# Altium project ADAPTONE_CARTE_DE_SON.PrjPCB (part 2 of 3)

## Sheet ADC.SchDoc
size Tabloid; DocumentNumber: 6; SheetNumber: 6; SheetTotal: 11; SheetName: ADC; Size: 11x17; Sheet_Name: ADC
Used 2 times, as channels ADC1, ADC2. Parts and nets are listed once, with the designators drawn on the sheet.
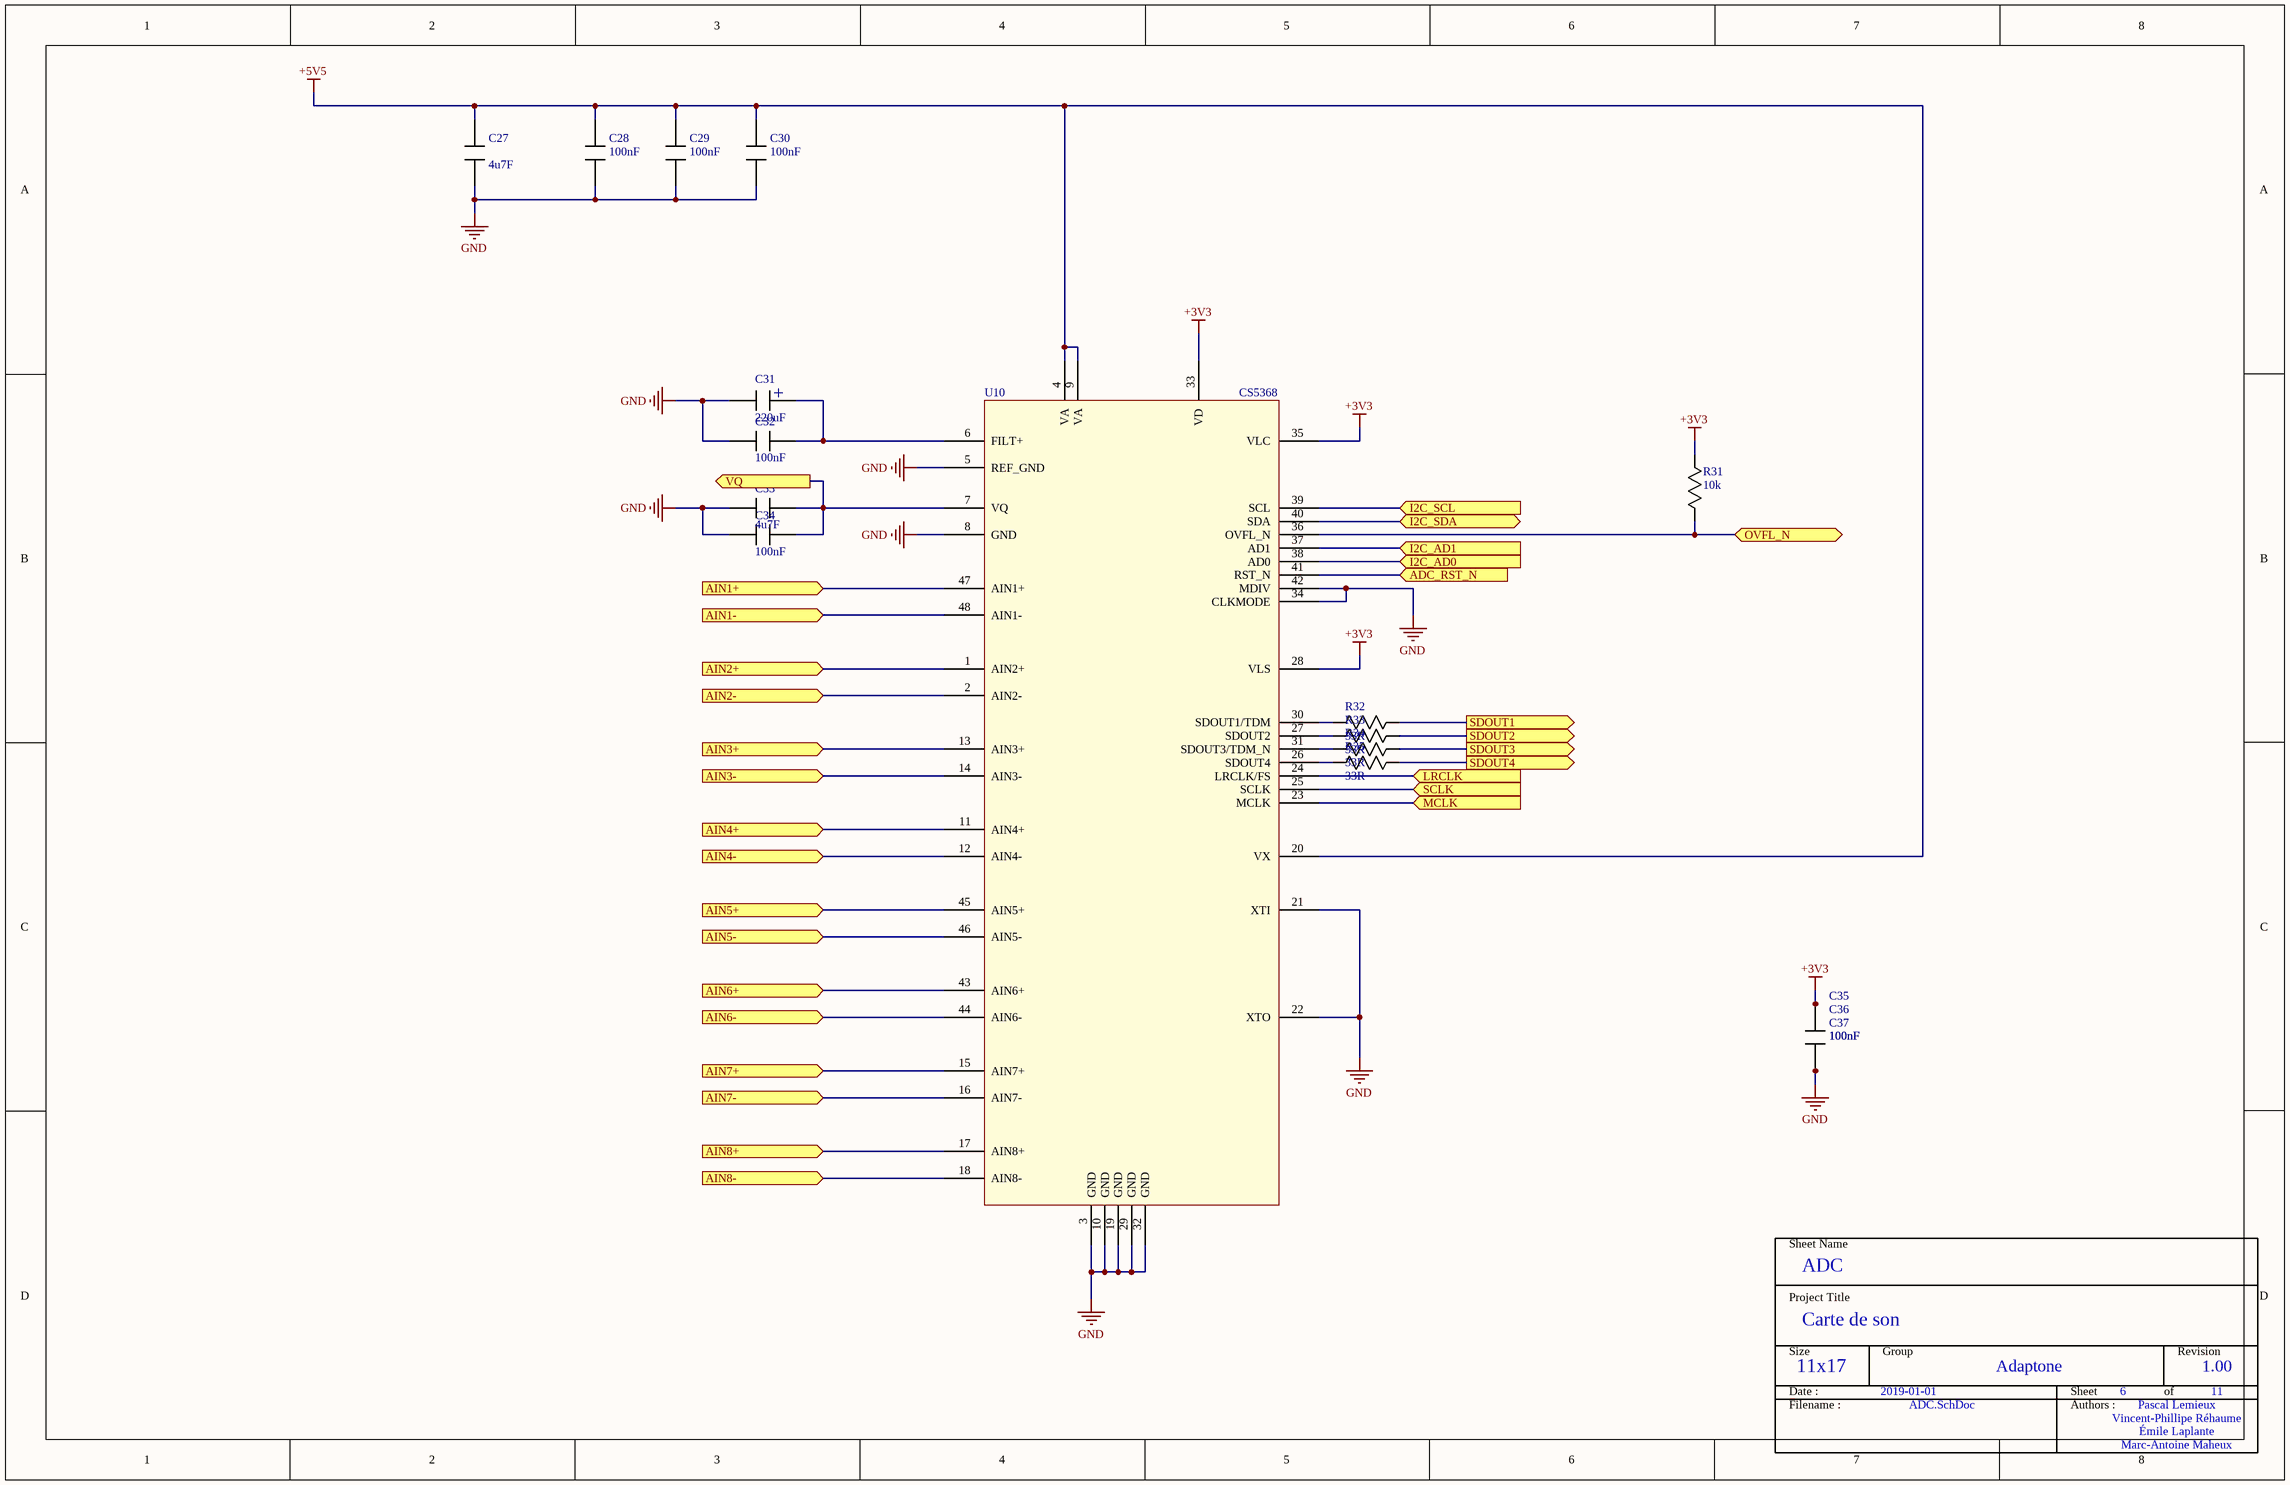
[diagram p5: ADC.SchDoc]

### Parts
C27  value 4u7F  [0805]  (hidden comment: Capacitor)
C28  value 100nF  [0603]  (hidden comment: Capacitor)
C29  value 100nF  [0603]  (hidden comment: Capacitor)
C30  value 100nF  [0603]  (hidden comment: Capacitor)
C31  value 220uF  [CAP_RAD_SMD_DIA315]  (hidden comment: Capacitor_Polarized_1)
C32  value 100nF  [0603]  (hidden comment: Capacitor)
C33  value 4u7F  [0805]  (hidden comment: Capacitor)
C34  value 100nF  [0603]  (hidden comment: Capacitor)
C35  value 100nF  [0603]  (hidden comment: Capacitor)
C36  value 100nF  [0603]  (hidden comment: Capacitor)
C37  value 100nF  [0603]  (hidden comment: Capacitor)
R31  value 10k  [0603]  (hidden comment: Resistor)
R32  value 33R  [0603]  (hidden comment: Resistor)
R33  value 33R  [0603]  (hidden comment: Resistor)
R34  value 33R  [0603]  (hidden comment: Resistor)
R35  value 33R  [0603]  (hidden comment: Resistor)
U10  CS5368  [LQFP_48L_CIRRUS]

### Ports
ADC_RST_N (in), AIN1+ (in), AIN1- (in), AIN2+ (in), AIN2- (in), AIN3+ (in), AIN3- (in), AIN4+ (in), AIN4- (in), AIN5+ (in), AIN5- (in), AIN6+ (in), AIN6- (in), AIN7+ (in), AIN7- (in), AIN8+ (in), AIN8- (in), I2C_AD0 (in), I2C_AD1 (in), I2C_SCL (in), I2C_SDA (bidir), LRCLK (in), MCLK (in), OVFL_N (bidir), SCLK (in), SDOUT1 (out), SDOUT2 (out), SDOUT3 (out), SDOUT4 (out), VQ (out)

### Nets
+3V3: C35.1 C36.1 C37.1 R31.1 U10.28(VLS) U10.33(VD) U10.35(VLC)
+5V5: C27.1 C28.1 C29.1 C30.1 U10.4(VA) U10.9(VA) U10.20(VX)
GND: C27.2 C28.2 C29.2 C30.2 C31.- C32.2 C33.2 C34.2 C35.2 C36.2 C37.2 U10.3(GND) U10.5(REF_GND) U10.8(GND) U10.10(GND) U10.19(GND) U10.21(XTI) U10.22(XTO) U10.29(GND) U10.32(GND) U10.34(CLKMODE) U10.42(MDIV)
ADC_RST_N: U10.41(RST_N) ; port ADC_RST_N
AIN1+: U10.47(AIN1+) ; port AIN1+
AIN1-: U10.48(AIN1-) ; port AIN1-
AIN2+: U10.1(AIN2+) ; port AIN2+
AIN2-: U10.2(AIN2-) ; port AIN2-
AIN3+: U10.13(AIN3+) ; port AIN3+
AIN3-: U10.14(AIN3-) ; port AIN3-
AIN4+: U10.11(AIN4+) ; port AIN4+
AIN4-: U10.12(AIN4-) ; port AIN4-
AIN5+: U10.45(AIN5+) ; port AIN5+
AIN5-: U10.46(AIN5-) ; port AIN5-
AIN6+: U10.43(AIN6+) ; port AIN6+
AIN6-: U10.44(AIN6-) ; port AIN6-
AIN7+: U10.15(AIN7+) ; port AIN7+
AIN7-: U10.16(AIN7-) ; port AIN7-
AIN8+: U10.17(AIN8+) ; port AIN8+
AIN8-: U10.18(AIN8-) ; port AIN8-
I2C_AD0: U10.38(AD0) ; port I2C_AD0
I2C_AD1: U10.37(AD1) ; port I2C_AD1
I2C_SCL: U10.39(SCL) ; port I2C_SCL
I2C_SDA: U10.40(SDA) ; port I2C_SDA
LRCLK: U10.24(LRCLK/FS) ; port LRCLK
MCLK: U10.23(MCLK) ; port MCLK
OVFL_N: R31.2 U10.36(OVFL_N) ; port OVFL_N
SCLK: U10.25(SCLK) ; port SCLK
SDOUT1: R32.2 ; port SDOUT1
SDOUT2: R33.2 ; port SDOUT2
SDOUT3: R34.2 ; port SDOUT3
SDOUT4: R35.2 ; port SDOUT4
VQ: C33.1 C34.1 U10.7(VQ) ; port VQ
NetC31_+: C31.+ C32.1 U10.6(FILT+)
NetR32_1: R32.1 U10.30(SDOUT1/TDM)
NetR33_1: R33.1 U10.27(SDOUT2)
NetR34_1: R34.1 U10.31(SDOUT3/TDM_N)
NetR35_1: R35.1 U10.26(SDOUT4)

### Channels
ADC1: designators end in .1; ports ADC_RST_N=NetTP6_1 AIN1+=IN1_P AIN1-=IN1_N AIN2+=IN2_P AIN2-=IN2_N AIN3+=IN3_P AIN3-=IN3_N AIN4+=IN4_P AIN4-=IN4_N AIN5+=IN5_P AIN5-=IN5_N AIN6+=IN6_P AIN6-=IN6_N AIN7+=IN7_P AIN7-=IN7_N AIN8+=IN8_P AIN8-=IN8_N I2C_AD0=+3V3 I2C_AD1=GND I2C_SCL=I2C_SCL I2C_SDA=I2C_SDA LRCLK=LRCLK MCLK=MCLK_AUDIO OVFL_N=NetR31.1_2 SCLK=SCLK SDOUT1=ADC1_SDOUT1 SDOUT2=ADC1_SDOUT2 SDOUT3=ADC1_SDOUT3 SDOUT4=ADC1_SDOUT4 VQ=ADC1_VQ
ADC2: designators end in .2; ports ADC_RST_N=NetTP6_1 AIN1+=IN9_P AIN1-=IN9_N AIN2+=IN10_P AIN2-=IN10_N AIN3+=IN11_P AIN3-=IN11_N AIN4+=IN12_P AIN4-=IN12_N AIN5+=IN13_P AIN5-=IN13_N AIN6+=IN14_P AIN6-=IN14_N AIN7+=IN15_P AIN7-=IN15_N AIN8+=IN16_P AIN8-=IN16_N I2C_AD0=GND I2C_AD1=GND I2C_SCL=I2C_SCL I2C_SDA=I2C_SDA LRCLK=LRCLK MCLK=MCLK_AUDIO OVFL_N=NetR31.1_2 SCLK=SCLK SDOUT1=ADC2_SDOUT1 SDOUT2=ADC2_SDOUT2 SDOUT3=ADC2_SDOUT3 SDOUT4=ADC2_SDOUT4 VQ=ADC2_VQ

### Notes on the sheet
- Sheet Name
- Project Title
- Size
- Group
- Revision
- Date :
- Filename :
- Sheet
- Authors :
- of

### Library data of the parts
C27 C33 = Capacitor: Mfg: Samsung; Mfg_PN: CL21A475KAQNNNG; HelpURL: *; NI: *; Supplier1: Digikey; Supplier1_PN: 1276-6462-1-ND; Tolerance: *; Type: *; Rating: *
C28-C30 C32 C34-C37 = Capacitor: Mfg: Samsung; Mfg_PN: CL10F104ZO8NNNC; HelpURL: *; NI: *; Supplier1: Digikey; Supplier1_PN: 1276-1258-1-ND; Tolerance: *; Type: *; Rating: *
C31 = Capacitor_Polarized_1: Capacitor; Mfg: Nichicon; Mfg_PN: UWT1E221MNL1GS; HelpURL: *; NI: *; Supplier1: Digikey; Supplier1_PN: 493-2192-1-ND; Tolerance: *; Type: *; Rating: *
R31 = Resistor: Mfg: Yageo; Mfg_PN: RC0603JR-0710KL; HelpURL: *; NI: *; Supplier1: Digikey; Supplier1_PN: 311-10KGRCT-ND; Type: *; Rating: *; Tolerance: *
R32-R35 = Resistor: Mfg: Yageo; Mfg_PN: RC0603JR-0733RL; HelpURL: *; NI: *; Supplier1: Digikey; Supplier1_PN: 311-33GRCT-ND; Type: *; Rating: *; Tolerance: *
U10 = CS5368: ADC, 24bit, 8 chan, 192kHz, PCM, TDM, LQFP48; Mfg_PN: CS5368-CQZ; Mfg: Cirrus; Supplier1: Digikey; Supplier1_PN: 598-1090-ND

## Sheet DAC.SchDoc
size Tabloid; DocumentNumber: 7; SheetNumber: 7; SheetTotal: 11; SheetName: DAC; Size: 11x17; Sheet_Name: DAC
Used 2 times, as channels DAC2, DAC1. Parts and nets are listed once, with the designators drawn on the sheet.
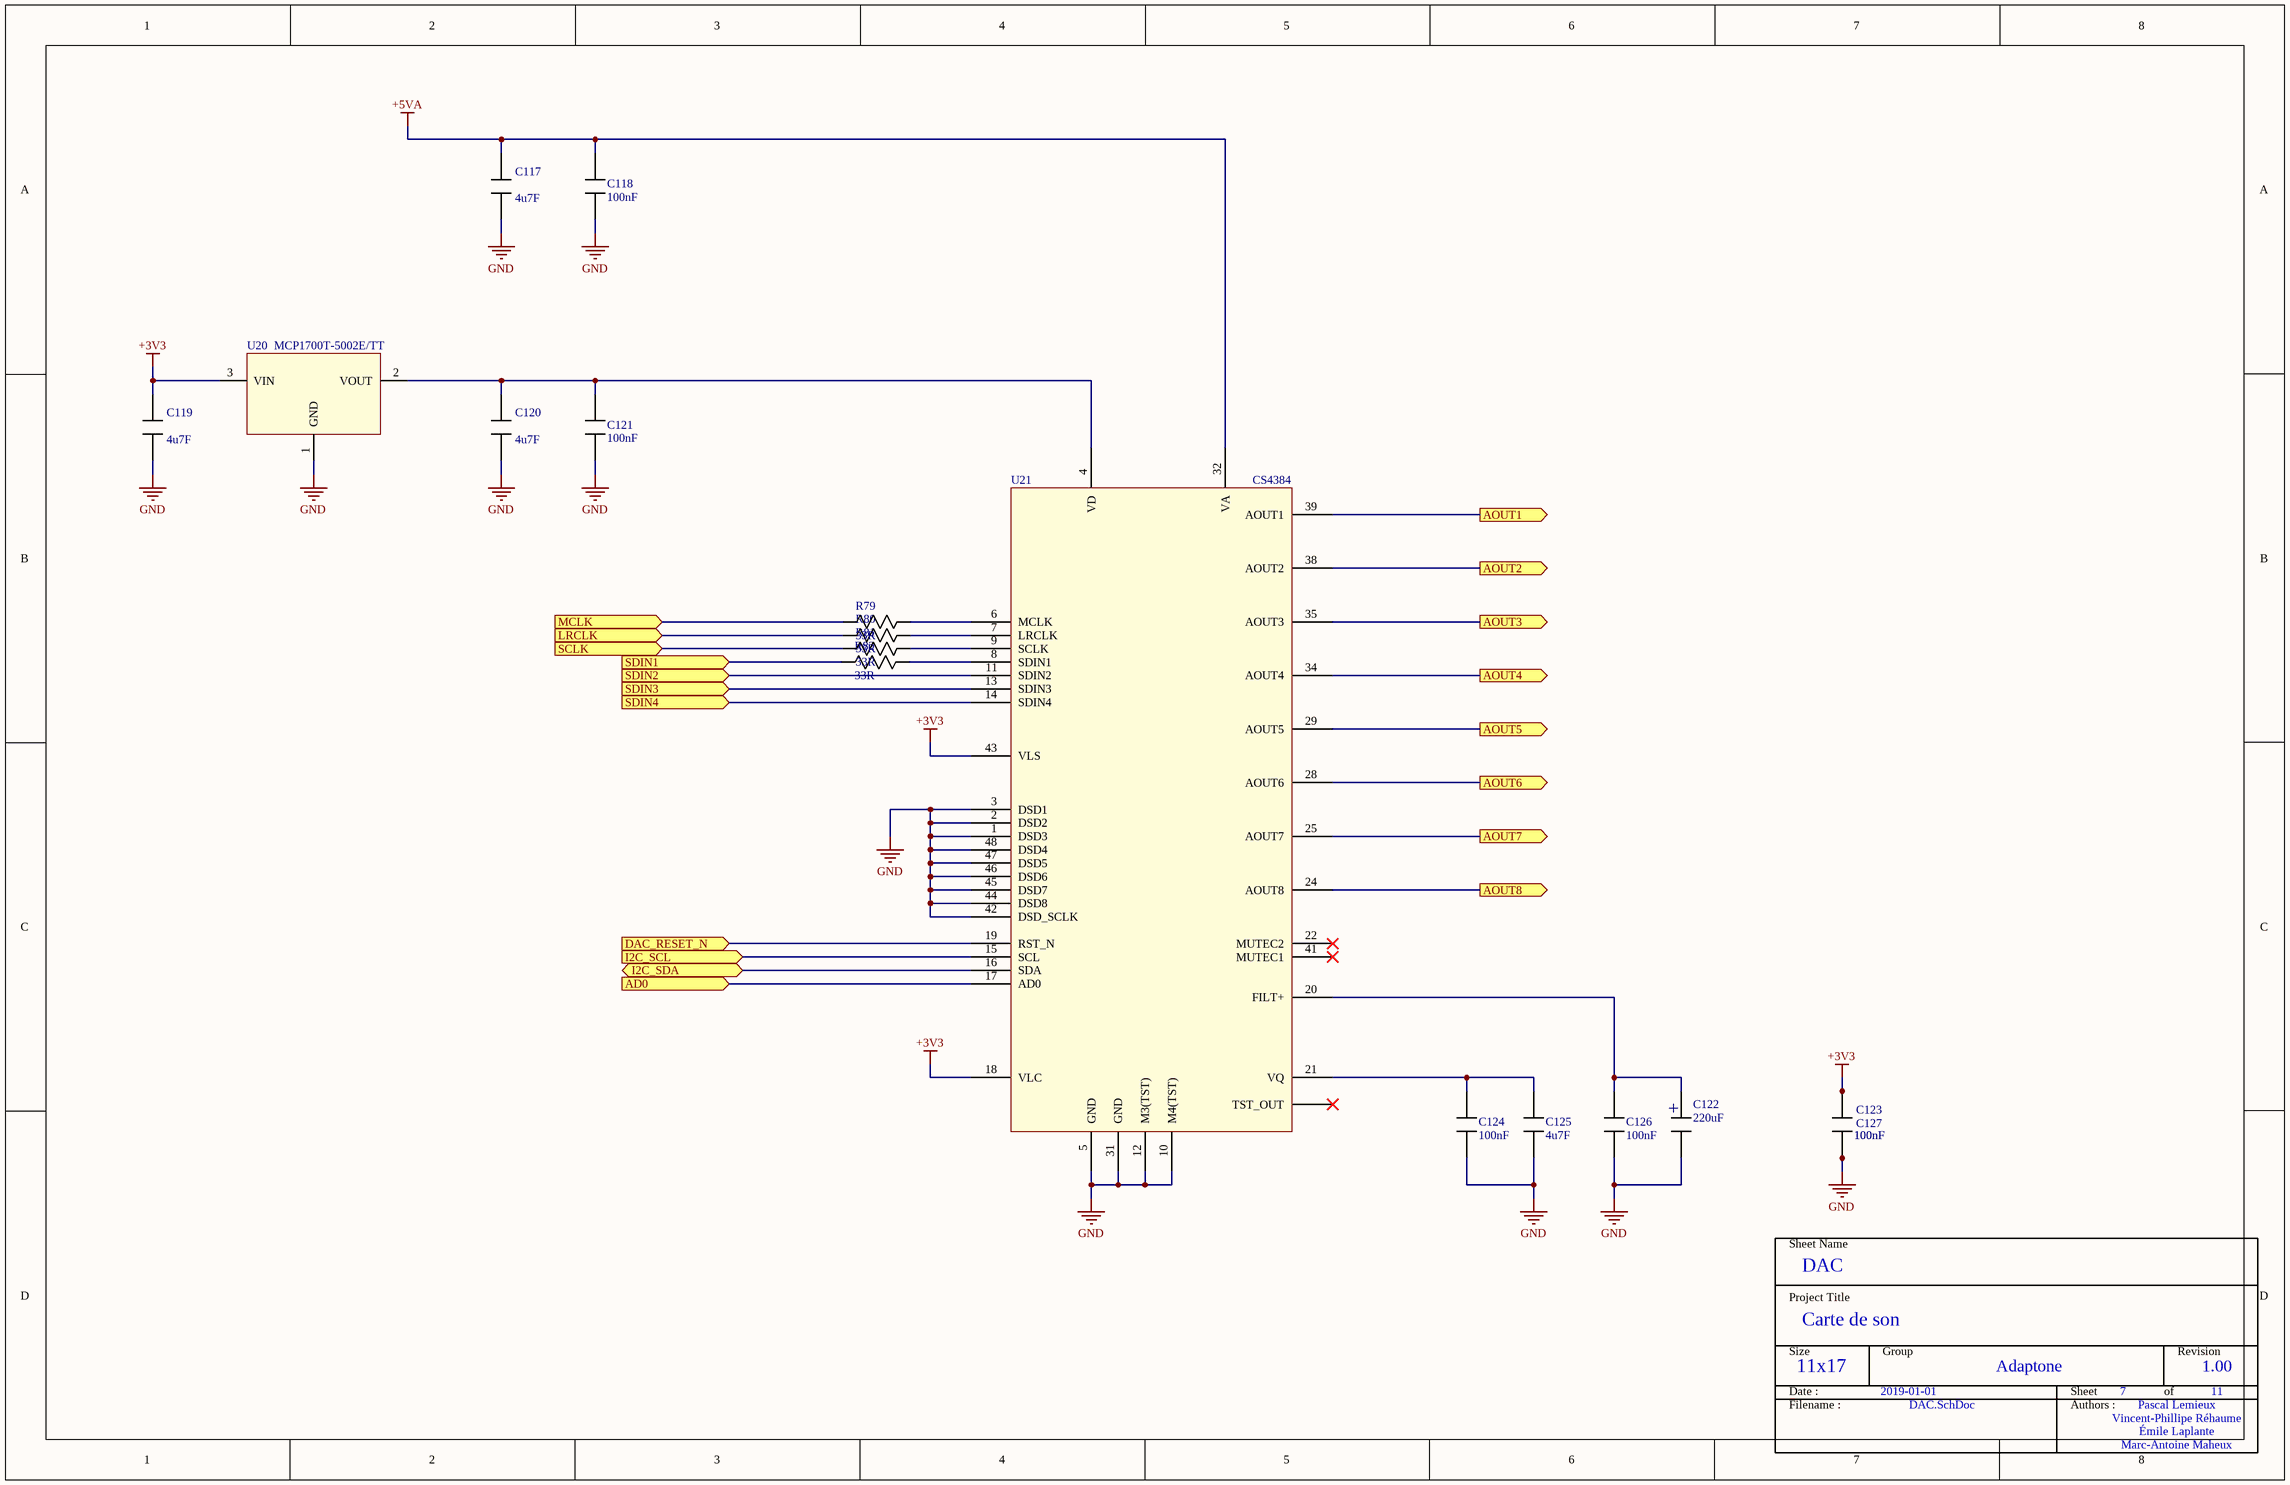
[diagram p6: DAC.SchDoc]

### Parts
C117  value 4u7F  [0603]  (hidden comment: Capacitor)
C118  value 100nF  [0603]  (hidden comment: Capacitor)
C119  value 4u7F  [0603]  (hidden comment: Capacitor)
C120  value 4u7F  [0603]  (hidden comment: Capacitor)
C121  value 100nF  [0603]  (hidden comment: Capacitor)
C122  value 220uF  [CAP_RAD_SMD_DIA315]  (hidden comment: Capacitor_Polarized_1)
C123  value 100nF  [0603]  (hidden comment: Capacitor)
C124  value 100nF  [0603]  (hidden comment: Capacitor)
C125  value 4u7F  [0603]  (hidden comment: Capacitor)
C126  value 100nF  [0603]  (hidden comment: Capacitor)
C127  value 100nF  [0603]  (hidden comment: Capacitor)
R79  value 33R  [0603]  (hidden comment: Resistor)
R80  value 33R  [0603]  (hidden comment: Resistor)
R81  value 33R  [0603]  (hidden comment: Resistor)
R82  value 33R  [0603]  (hidden comment: Resistor)
U20  Mfg_PN: MCP1700T-5002E/TT  [SOT23_132]  (hidden comment: MCP1700)
U21  CS4384  [LQFP_48L_CIRRUS]

### Ports
AD0 (in), AOUT1 (out), AOUT2 (out), AOUT3 (out), AOUT4 (out), AOUT5 (out), AOUT6 (out), AOUT7 (out), AOUT8 (out), DAC_RESET_N (in), I2C_SCL (in), I2C_SDA (bidir), LRCLK (in), MCLK (in), SCLK (in), SDIN1 (in), SDIN2 (in), SDIN3 (in), SDIN4 (in)

### Nets
+3V3: C119.1 C123.1 C127.1 U20.3(VIN) U21.18(VLC) U21.43(VLS)
+5VA: C117.1 C118.1 U21.32(VA)
GND: C117.2 C118.2 C119.2 C120.2 C121.2 C122.- C123.2 C124.2 C125.2 C126.2 C127.2 U20.1(GND) U21.1(DSD3) U21.2(DSD2) U21.3(DSD1) U21.5(GND) U21.10(M4(TST)) U21.12(M3(TST)) U21.31(GND) U21.42(DSD_SCLK) U21.44(DSD8) U21.45(DSD7) U21.46(DSD6) U21.47(DSD5) U21.48(DSD4)
AD0: U21.17(AD0) ; port AD0
AOUT1: U21.39(AOUT1) ; port AOUT1
AOUT2: U21.38(AOUT2) ; port AOUT2
AOUT3: U21.35(AOUT3) ; port AOUT3
AOUT4: U21.34(AOUT4) ; port AOUT4
AOUT5: U21.29(AOUT5) ; port AOUT5
AOUT6: U21.28(AOUT6) ; port AOUT6
AOUT7: U21.25(AOUT7) ; port AOUT7
AOUT8: U21.24(AOUT8) ; port AOUT8
DAC_RESET_N: U21.19(RST_N) ; port DAC_RESET_N
I2C_SCL: U21.15(SCL) ; port I2C_SCL
I2C_SDA: U21.16(SDA) ; port I2C_SDA
LRCLK: R80.1 ; port LRCLK
MCLK: R79.1 ; port MCLK
SCLK: R81.1 ; port SCLK
SDIN1: R82.1 ; port SDIN1
SDIN2: U21.11(SDIN2) ; port SDIN2
SDIN3: U21.13(SDIN3) ; port SDIN3
SDIN4: U21.14(SDIN4) ; port SDIN4
NetC120_1: C120.1 C121.1 U20.2(VOUT) U21.4(VD)
NetC122_+: C122.+ C126.1 U21.20(FILT+)
NetC124_1: C124.1 C125.1 U21.21(VQ)
NetR79_2: R79.2 U21.6(MCLK)
NetR80_2: R80.2 U21.7(LRCLK)
NetR81_2: R81.2 U21.9(SCLK)
NetR82_2: R82.2 U21.8(SDIN1)

Not connected (* = marked no-connect by the designer): U21 22(MUTEC2)* 23(TST_OUT) 26(TST_OUT) 27(TST_OUT) 30(TST_OUT) 33(TST_OUT) 36(TST_OUT) 37(TST_OUT) 40(TST_OUT)* 41(MUTEC1)*

### Channels
DAC2: designators end in .1; ports AD0=+3V3 AOUT1=AOUT9 AOUT2=AOUT10 AOUT3=AOUT11 AOUT4=AOUT12 AOUT5=AOUT13 AOUT6=AOUT14 AOUT7=AOUT15 AOUT8=AOUT16 DAC_RESET_N=NetU8_94 I2C_SCL=I2C_SCL I2C_SDA=I2C_SDA LRCLK=FSYNC MCLK=MCLK_AUDIO SCLK=BCLK SDIN1=DAC2_SDIN1_TDM SDIN2=NetU21.1_11 SDIN3=NetU21.1_13 SDIN4=NetU21.1_14
DAC1: designators end in .2; ports AD0=GND AOUT1=AOUT1 AOUT2=AOUT2 AOUT3=AOUT3 AOUT4=AOUT4 AOUT5=AOUT5 AOUT6=AOUT6 AOUT7=AOUT7 AOUT8=AOUT8 DAC_RESET_N=NetU8_94 I2C_SCL=I2C_SCL I2C_SDA=I2C_SDA LRCLK=FSYNC MCLK=MCLK_AUDIO SCLK=BCLK SDIN1=DAC1_SDIN1_TDM SDIN2=NetU21.2_11 SDIN3=NetU21.2_13 SDIN4=NetU21.2_14

### Notes on the sheet
- Sheet Name
- Project Title
- Size
- Group
- Revision
- Date :
- Filename :
- Sheet
- Authors :
- of

### Library data of the parts
C117 C119 C120 C125 = Capacitor: Mfg: Samsung; Mfg_PN: CL21A475KAQNNNG; HelpURL: *; NI: *; Supplier1: Digikey; Supplier1_PN: 1276-6462-1-ND; Tolerance: *; Type: *; Rating: *
C118 C121 C123 C124 C126 C127 = Capacitor: Mfg: Samsung; Mfg_PN: CL10F104ZO8NNNC; HelpURL: *; NI: *; Supplier1: Digikey; Supplier1_PN: 1276-1258-1-ND; Tolerance: *; Type: *; Rating: *
C122 = Capacitor_Polarized_1: as C31 on sheet ADC; HelpURL: *; NI: *; Supplier1: Digikey; Supplier1_PN: 493-2192-1-ND; Tolerance: *; Type: *; Rating: *
R79-R82 = Resistor: Mfg: Yageo; Mfg_PN: RC0603JR-0733RL; HelpURL: *; NI: *; Supplier1: Digikey; Supplier1_PN: 311-33GRCT-ND; Type: *; Rating: *; Tolerance: *
U20 = MCP1700: Linear voltage regulator; Mfg: Microchip; HelpURL: http://ww1.microchip.com/downloads/en/DeviceDoc/20001826C.pdf; NI: *; Supplier1: Digikey; Supplier1_PN: MCP1700T5002ETTCT-ND; Type: *
U21 = CS4384: DAC, 24-bit, 8 chan, 192kHz, PCM, TDM, DSD, LQFP48; Mfg: Cirrus; Mfg_PN: CS4384-CQZ; Supplier1: Digikey; Supplier1_PN: 598-1062-ND

## Sheet AudioInputs_16.SchDoc
size Tabloid; DocumentNumber: 10; SheetNumber: 10; SheetTotal: 11; SheetName: Analog input (group); Size: 11x17; Sheet_Name: AudiInputs_16
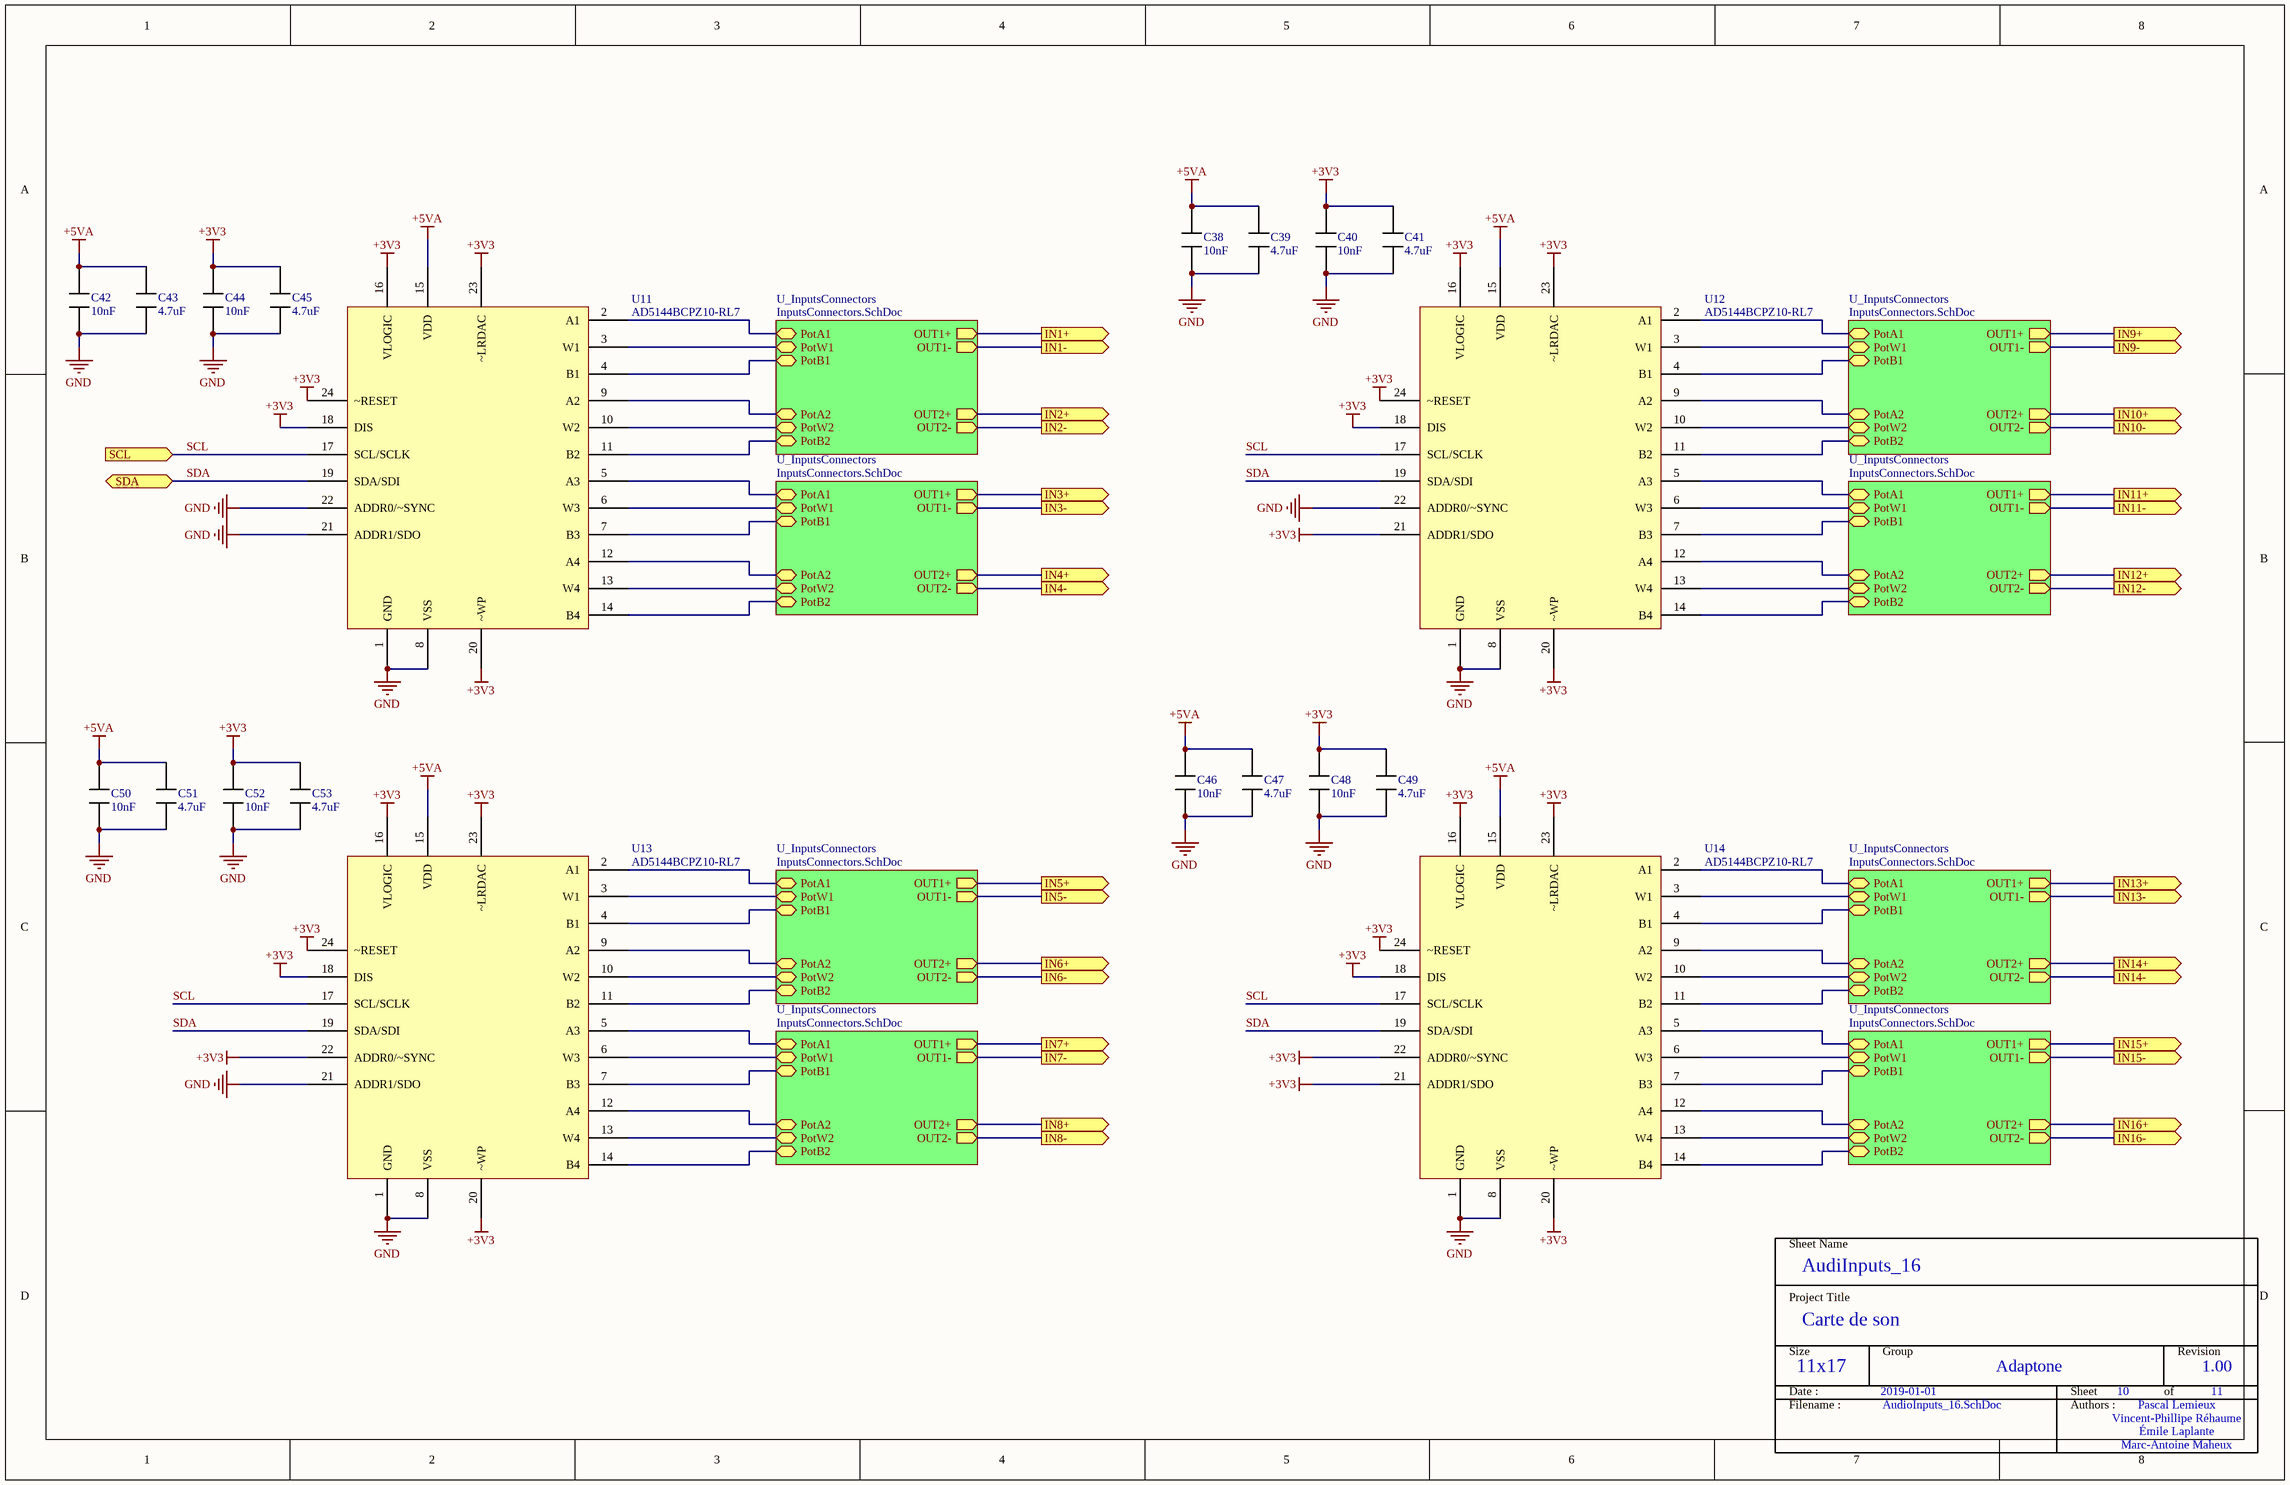
[diagram p7: AudioInputs_16.SchDoc]

### Parts
C38  value 10nF  [0402]  (hidden comment: Capacitor)
C39  value 4.7uF  [0402]  (hidden comment: Capacitor)
C40  value 10nF  [0402]  (hidden comment: Capacitor)
C41  value 4.7uF  [0402]  (hidden comment: Capacitor)
C42  value 10nF  [0402]  (hidden comment: Capacitor)
C43  value 4.7uF  [0402]  (hidden comment: Capacitor)
C44  value 10nF  [0402]  (hidden comment: Capacitor)
C45  value 4.7uF  [0402]  (hidden comment: Capacitor)
C46  value 10nF  [0402]  (hidden comment: Capacitor)
C47  value 4.7uF  [0402]  (hidden comment: Capacitor)
C48  value 10nF  [0402]  (hidden comment: Capacitor)
C49  value 4.7uF  [0402]  (hidden comment: Capacitor)
C50  value 10nF  [0402]  (hidden comment: Capacitor)
C51  value 4.7uF  [0402]  (hidden comment: Capacitor)
C52  value 10nF  [0402]  (hidden comment: Capacitor)
C53  value 4.7uF  [0402]  (hidden comment: Capacitor)
U11  AD5144BCPZ10-RL7  [QFN50P400X400X100-25N]
U12  AD5144BCPZ10-RL7  [QFN50P400X400X100-25N]
U13  AD5144BCPZ10-RL7  [QFN50P400X400X100-25N]
U14  AD5144BCPZ10-RL7  [QFN50P400X400X100-25N]

### Sub-sheets
U_InputsConnectors = InputsConnectors.SchDoc: OUT1+ (out), OUT1- (out), OUT2+ (out), OUT2- (out), PotA1 (bidir), PotW1 (bidir), PotB1 (bidir), PotA2 (bidir), PotW2 (bidir), PotB2 (bidir)
U_InputsConnectors = InputsConnectors.SchDoc: OUT1+ (out), OUT1- (out), OUT2+ (out), OUT2- (out), PotA1 (bidir), PotW1 (bidir), PotB1 (bidir), PotA2 (bidir), PotW2 (bidir), PotB2 (bidir)
U_InputsConnectors = InputsConnectors.SchDoc: OUT1+ (out), OUT1- (out), OUT2+ (out), OUT2- (out), PotA1 (bidir), PotW1 (bidir), PotB1 (bidir), PotA2 (bidir), PotW2 (bidir), PotB2 (bidir)
U_InputsConnectors = InputsConnectors.SchDoc: OUT1+ (out), OUT1- (out), OUT2+ (out), OUT2- (out), PotA1 (bidir), PotW1 (bidir), PotB1 (bidir), PotA2 (bidir), PotW2 (bidir), PotB2 (bidir)
U_InputsConnectors = InputsConnectors.SchDoc: OUT1+ (out), OUT1- (out), OUT2+ (out), OUT2- (out), PotA1 (bidir), PotW1 (bidir), PotB1 (bidir), PotA2 (bidir), PotW2 (bidir), PotB2 (bidir)
U_InputsConnectors = InputsConnectors.SchDoc: OUT1+ (out), OUT1- (out), OUT2+ (out), OUT2- (out), PotA1 (bidir), PotW1 (bidir), PotB1 (bidir), PotA2 (bidir), PotW2 (bidir), PotB2 (bidir)
U_InputsConnectors = InputsConnectors.SchDoc: OUT1+ (out), OUT1- (out), OUT2+ (out), OUT2- (out), PotA1 (bidir), PotW1 (bidir), PotB1 (bidir), PotA2 (bidir), PotW2 (bidir), PotB2 (bidir)
U_InputsConnectors = InputsConnectors.SchDoc: OUT1+ (out), OUT1- (out), OUT2+ (out), OUT2- (out), PotA1 (bidir), PotW1 (bidir), PotB1 (bidir), PotA2 (bidir), PotW2 (bidir), PotB2 (bidir)

### Ports
IN1+ (out), IN1- (out), IN2+ (out), IN2- (out), IN3+ (out), IN3- (out), IN4+ (out), IN4- (out), IN5+ (out), IN5- (out), IN6+ (out), IN6- (out), IN7+ (out), IN7- (out), IN8+ (out), IN8- (out), IN9+ (out), IN9- (out), IN10+ (out), IN10- (out), IN11+ (out), IN11- (out), IN12+ (out), IN12- (out), IN13+ (out), IN13- (out), IN14+ (out), IN14- (out), IN15+ (out), IN15- (out), IN16+ (out), IN16- (out), SCL (in), SDA (bidir)

### Nets
+3V3: C40.1 C41.1 C44.1 C45.1 C48.1 C49.1 C52.1 C53.1 U11.16(VLOGIC) U11.18(DIS) U11.20(~WP) U11.23(~LRDAC) U11.24(~RESET) U12.16(VLOGIC) U12.18(DIS) U12.20(~WP) U12.21(ADDR1/SDO) U12.23(~LRDAC) U12.24(~RESET) U13.16(VLOGIC) U13.18(DIS) U13.20(~WP) U13.22(ADDR0/~SYNC) U13.23(~LRDAC) U13.24(~RESET) U14.16(VLOGIC) U14.18(DIS) U14.20(~WP) U14.21(ADDR1/SDO) U14.22(ADDR0/~SYNC) U14.23(~LRDAC) U14.24(~RESET)
+5VA: C38.1 C39.1 C42.1 C43.1 C46.1 C47.1 C50.1 C51.1 U11.15(VDD) U12.15(VDD) U13.15(VDD) U14.15(VDD)
GND: C38.2 C39.2 C40.2 C41.2 C42.2 C43.2 C44.2 C45.2 C46.2 C47.2 C48.2 C49.2 C50.2 C51.2 C52.2 C53.2 U11.1(GND) U11.8(VSS) U11.21(ADDR1/SDO) U11.22(ADDR0/~SYNC) U12.1(GND) U12.8(VSS) U12.22(ADDR0/~SYNC) U13.1(GND) U13.8(VSS) U13.21(ADDR1/SDO) U14.1(GND) U14.8(VSS)
IN1_N: port IN1-, sheet U_InputsConnectors/OUT1-
IN1_P: port IN1+, sheet U_InputsConnectors/OUT1+
IN2_N: port IN2-, sheet U_InputsConnectors/OUT2-
IN2_P: port IN2+, sheet U_InputsConnectors/OUT2+
IN3_N: port IN3-, sheet U_InputsConnectors/OUT1-
IN3_P: port IN3+, sheet U_InputsConnectors/OUT1+
IN4_N: port IN4-, sheet U_InputsConnectors/OUT2-
IN4_P: port IN4+, sheet U_InputsConnectors/OUT2+
IN5_N: port IN5-, sheet U_InputsConnectors/OUT1-
IN5_P: port IN5+, sheet U_InputsConnectors/OUT1+
IN6_N: port IN6-, sheet U_InputsConnectors/OUT2-
IN6_P: port IN6+, sheet U_InputsConnectors/OUT2+
IN7_N: port IN7-, sheet U_InputsConnectors/OUT1-
IN7_P: port IN7+, sheet U_InputsConnectors/OUT1+
IN8_N: port IN8-, sheet U_InputsConnectors/OUT2-
IN8_P: port IN8+, sheet U_InputsConnectors/OUT2+
IN9_N: port IN9-, sheet U_InputsConnectors/OUT1-
IN9_P: port IN9+, sheet U_InputsConnectors/OUT1+
IN10_N: port IN10-, sheet U_InputsConnectors/OUT2-
IN10_P: port IN10+, sheet U_InputsConnectors/OUT2+
IN11_N: port IN11-, sheet U_InputsConnectors/OUT1-
IN11_P: port IN11+, sheet U_InputsConnectors/OUT1+
IN12_N: port IN12-, sheet U_InputsConnectors/OUT2-
IN12_P: port IN12+, sheet U_InputsConnectors/OUT2+
IN13_N: port IN13-, sheet U_InputsConnectors/OUT1-
IN13_P: port IN13+, sheet U_InputsConnectors/OUT1+
IN14_N: port IN14-, sheet U_InputsConnectors/OUT2-
IN14_P: port IN14+, sheet U_InputsConnectors/OUT2+
IN15_N: port IN15-, sheet U_InputsConnectors/OUT1-
IN15_P: port IN15+, sheet U_InputsConnectors/OUT1+
IN16_N: port IN16-, sheet U_InputsConnectors/OUT2-
IN16_P: port IN16+, sheet U_InputsConnectors/OUT2+
SCL: U11.17(SCL/SCLK) U12.17(SCL/SCLK) U13.17(SCL/SCLK) U14.17(SCL/SCLK) ; port SCL  [project net I2C_SCL]
SDA: U11.19(SDA/SDI) U12.19(SDA/SDI) U13.19(SDA/SDI) U14.19(SDA/SDI) ; port SDA  [project net I2C_SDA]
V1: U11.3(W1) ; sheet U_InputsConnectors/PotW1
V1: U11.6(W3) ; sheet U_InputsConnectors/PotW1  [a separate net that carries the same name]
V1: U11.10(W2) ; sheet U_InputsConnectors/PotW2  [a separate net that carries the same name]
V1: U11.13(W4) ; sheet U_InputsConnectors/PotW2  [a separate net that carries the same name]
V1: U13.3(W1) ; sheet U_InputsConnectors/PotW1  [a separate net that carries the same name]
V1: U13.6(W3) ; sheet U_InputsConnectors/PotW1  [a separate net that carries the same name]
V1: U13.10(W2) ; sheet U_InputsConnectors/PotW2  [a separate net that carries the same name]
V1: U13.13(W4) ; sheet U_InputsConnectors/PotW2  [a separate net that carries the same name]
V1: U12.3(W1) ; sheet U_InputsConnectors/PotW1  [a separate net that carries the same name]
V1: U12.6(W3) ; sheet U_InputsConnectors/PotW1  [a separate net that carries the same name]
V1: U12.10(W2) ; sheet U_InputsConnectors/PotW2  [a separate net that carries the same name]
V1: U12.13(W4) ; sheet U_InputsConnectors/PotW2  [a separate net that carries the same name]
V1: U14.3(W1) ; sheet U_InputsConnectors/PotW1  [a separate net that carries the same name]
V1: U14.6(W3) ; sheet U_InputsConnectors/PotW1  [a separate net that carries the same name]
V1: U14.10(W2) ; sheet U_InputsConnectors/PotW2  [a separate net that carries the same name]
V1: U14.13(W4) ; sheet U_InputsConnectors/PotW2  [a separate net that carries the same name]
NetR62.1_1: U11.2(A1) ; sheet U_InputsConnectors/PotA1
NetR62.2_1: U11.9(A2) ; sheet U_InputsConnectors/PotA2
NetR62.3_1: U11.5(A3) ; sheet U_InputsConnectors/PotA1
NetR62.4_1: U11.12(A4) ; sheet U_InputsConnectors/PotA2
NetR62.5_1: U13.2(A1) ; sheet U_InputsConnectors/PotA1
NetR62.6_1: U13.9(A2) ; sheet U_InputsConnectors/PotA2
NetR62.7_1: U13.5(A3) ; sheet U_InputsConnectors/PotA1
NetR62.8_1: U13.12(A4) ; sheet U_InputsConnectors/PotA2
NetR62.9_1: U12.2(A1) ; sheet U_InputsConnectors/PotA1
NetR62.10_1: U12.9(A2) ; sheet U_InputsConnectors/PotA2
NetR62.11_1: U12.5(A3) ; sheet U_InputsConnectors/PotA1
NetR62.12_1: U12.12(A4) ; sheet U_InputsConnectors/PotA2
NetR62.13_1: U14.2(A1) ; sheet U_InputsConnectors/PotA1
NetR62.14_1: U14.9(A2) ; sheet U_InputsConnectors/PotA2
NetR62.15_1: U14.5(A3) ; sheet U_InputsConnectors/PotA1
NetR62.16_1: U14.12(A4) ; sheet U_InputsConnectors/PotA2
NetR63.1_2: U11.4(B1) ; sheet U_InputsConnectors/PotB1
NetR63.2_2: U11.11(B2) ; sheet U_InputsConnectors/PotB2
NetR63.3_2: U11.7(B3) ; sheet U_InputsConnectors/PotB1
NetR63.4_2: U11.14(B4) ; sheet U_InputsConnectors/PotB2
NetR63.5_2: U13.4(B1) ; sheet U_InputsConnectors/PotB1
NetR63.6_2: U13.11(B2) ; sheet U_InputsConnectors/PotB2
NetR63.7_2: U13.7(B3) ; sheet U_InputsConnectors/PotB1
NetR63.8_2: U13.14(B4) ; sheet U_InputsConnectors/PotB2
NetR63.9_2: U12.4(B1) ; sheet U_InputsConnectors/PotB1
NetR63.10_2: U12.11(B2) ; sheet U_InputsConnectors/PotB2
NetR63.11_2: U12.7(B3) ; sheet U_InputsConnectors/PotB1
NetR63.12_2: U12.14(B4) ; sheet U_InputsConnectors/PotB2
NetR63.13_2: U14.4(B1) ; sheet U_InputsConnectors/PotB1
NetR63.14_2: U14.11(B2) ; sheet U_InputsConnectors/PotB2
NetR63.15_2: U14.7(B3) ; sheet U_InputsConnectors/PotB1
NetR63.16_2: U14.14(B4) ; sheet U_InputsConnectors/PotB2

### Notes on the sheet
- Sheet Name
- Project Title
- Size
- Group
- Revision
- Date :
- Filename :
- Sheet
- Authors :
- of

### Library data of the parts
C38 C40 C42 C44 C46 C48 C50 C52 = Capacitor: Mfg: Samsung; Mfg_PN: CL05B103KO5NNNC; HelpURL: *; NI: *; Supplier1: Digikey; Supplier1_PN: 1276-1051-1-ND; Tolerance: *; Type: *; Rating: *
C39 C41 C43 C45 C47 C49 C51 C53 = Capacitor: Mfg: Samsung; Mfg_PN: CL05A475MP5NRNC; HelpURL: *; NI: *; Supplier1: Digikey; Supplier1_PN: 1276-1482-1-ND; Tolerance: *; Type: *; Rating: *
U11-U14 = AD5144BCPZ10-RL7: Mfg: Analog Devices Inc.; Mfg_PN: AD5144BCPZ10-RL7; Supplier1: Digikey; Supplier1_PN: AD5144BCPZ10-RL7DKR-ND

## Sheet InputsConnectors.SchDoc
size Tabloid; Size: 11x17; Sheet_Name: InputsConnectors
Used 8 times, as channels AUDIO INPUTS/U_InputsConnectors, AUDIO INPUTS/U_InputsConnectors, AUDIO INPUTS/U_InputsConnectors, AUDIO INPUTS/U_InputsConnectors, AUDIO INPUTS/U_InputsConnectors, AUDIO INPUTS/U_InputsConnectors, AUDIO INPUTS/U_InputsConnectors, AUDIO INPUTS/U_InputsConnectors. Parts and nets are listed once, with the designators drawn on the sheet.
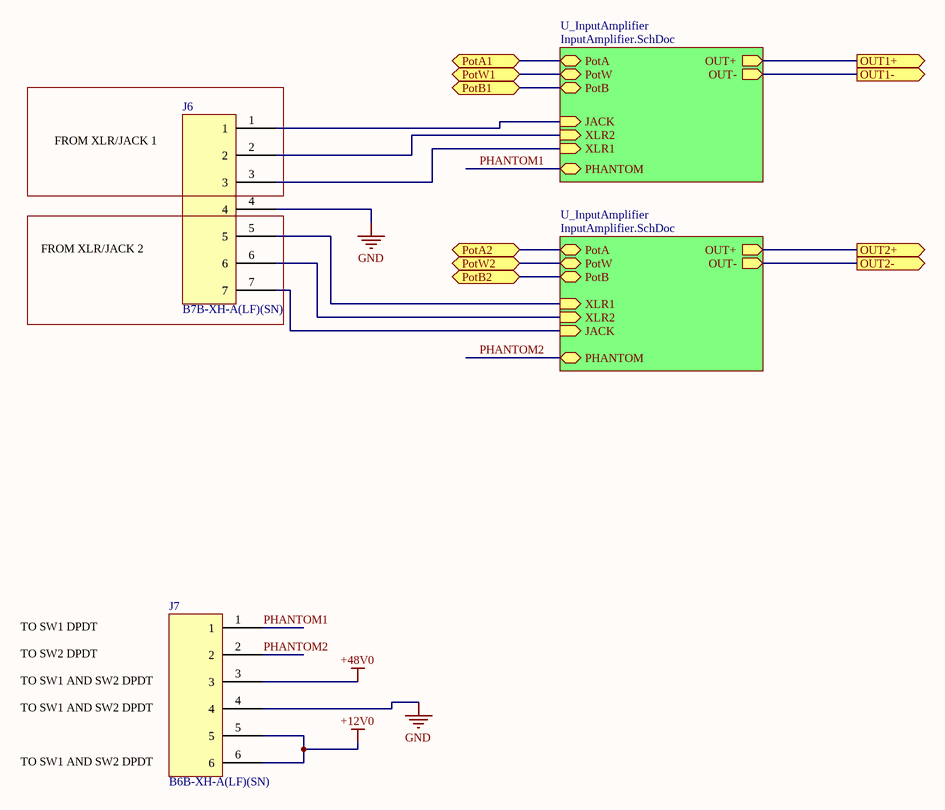
[diagram p8: InputsConnectors.SchDoc]

### Parts
J6  B7B-XH-A(LF)(SN)  [CONN_7_HEADER]
J7  Mfg_PN: B6B-XH-A(LF)(SN)  [CONN_6_HEADER]  (hidden comment: CON_XH_JST_6pins)

### Sub-sheets
U_InputAmplifier = InputAmplifier.SchDoc: OUT+ (out), OUT- (out), PotA (bidir), PotB (bidir), PotW (bidir), XLR1 (in), XLR2 (in), PHANTOM (bidir), JACK (in)
U_InputAmplifier = InputAmplifier.SchDoc: OUT+ (out), OUT- (out), PotA (bidir), PotB (bidir), PotW (bidir), XLR1 (in), XLR2 (in), PHANTOM (bidir), JACK (in)

### Ports
OUT1+ (out), OUT1- (out), OUT2+ (out), OUT2- (out), PotA1 (bidir), PotA2 (bidir), PotB1 (bidir), PotB2 (bidir), PotW1 (bidir), PotW2 (bidir)

### Nets
+12V0: J7.5 J7.6
+48V0: J7.3
GND: J6.4 J7.4
OUT1+: port OUT1+, sheet U_InputAmplifier/OUT+
OUT1-: port OUT1-, sheet U_InputAmplifier/OUT-
OUT2+: port OUT2+, sheet U_InputAmplifier/OUT+
OUT2-: port OUT2-, sheet U_InputAmplifier/OUT-
PHANTOM1: J7.1 ; sheet U_InputAmplifier/PHANTOM
PHANTOM2: J7.2 ; sheet U_InputAmplifier/PHANTOM
PotA1: port PotA1, sheet U_InputAmplifier/PotA
PotA2: port PotA2, sheet U_InputAmplifier/PotA
PotB1: port PotB1, sheet U_InputAmplifier/PotB
PotB2: port PotB2, sheet U_InputAmplifier/PotB
PotW1: port PotW1, sheet U_InputAmplifier/PotW
PotW2: port PotW2, sheet U_InputAmplifier/PotW
NetJ6_1: J6.1 ; sheet U_InputAmplifier/JACK
NetJ6_2: J6.2 ; sheet U_InputAmplifier/XLR2
NetJ6_3: J6.3 ; sheet U_InputAmplifier/XLR1
NetJ6_5: J6.5 ; sheet U_InputAmplifier/XLR1
NetJ6_6: J6.6 ; sheet U_InputAmplifier/XLR2
NetJ6_7: J6.7 ; sheet U_InputAmplifier/JACK

### Channels
AUDIO INPUTS/U_InputsConnectors: designators end in .1; ports OUT1+=IN1_P OUT1-=IN1_N OUT2+=IN2_P OUT2-=IN2_N PotA1=NetR62.1_1 PotA2=NetR62.2_1 PotB1=NetR63.1_2 PotB2=NetR63.2_2 PotW1=V1 PotW2=V1
AUDIO INPUTS/U_InputsConnectors: designators end in .2; ports OUT1+=IN3_P OUT1-=IN3_N OUT2+=IN4_P OUT2-=IN4_N PotA1=NetR62.3_1 PotA2=NetR62.4_1 PotB1=NetR63.3_2 PotB2=NetR63.4_2 PotW1=V1 PotW2=V1
AUDIO INPUTS/U_InputsConnectors: designators end in .3; ports OUT1+=IN5_P OUT1-=IN5_N OUT2+=IN6_P OUT2-=IN6_N PotA1=NetR62.5_1 PotA2=NetR62.6_1 PotB1=NetR63.5_2 PotB2=NetR63.6_2 PotW1=V1 PotW2=V1
AUDIO INPUTS/U_InputsConnectors: designators end in .4; ports OUT1+=IN7_P OUT1-=IN7_N OUT2+=IN8_P OUT2-=IN8_N PotA1=NetR62.7_1 PotA2=NetR62.8_1 PotB1=NetR63.7_2 PotB2=NetR63.8_2 PotW1=V1 PotW2=V1
AUDIO INPUTS/U_InputsConnectors: designators end in .5; ports OUT1+=IN9_P OUT1-=IN9_N OUT2+=IN10_P OUT2-=IN10_N PotA1=NetR62.9_1 PotA2=NetR62.10_1 PotB1=NetR63.9_2 PotB2=NetR63.10_2 PotW1=V1 PotW2=V1
AUDIO INPUTS/U_InputsConnectors: designators end in .6; ports OUT1+=IN11_P OUT1-=IN11_N OUT2+=IN12_P OUT2-=IN12_N PotA1=NetR62.11_1 PotA2=NetR62.12_1 PotB1=NetR63.11_2 PotB2=NetR63.12_2 PotW1=V1 PotW2=V1
AUDIO INPUTS/U_InputsConnectors: designators end in .7; ports OUT1+=IN13_P OUT1-=IN13_N OUT2+=IN14_P OUT2-=IN14_N PotA1=NetR62.13_1 PotA2=NetR62.14_1 PotB1=NetR63.13_2 PotB2=NetR63.14_2 PotW1=V1 PotW2=V1
AUDIO INPUTS/U_InputsConnectors: designators end in .8; ports OUT1+=IN15_P OUT1-=IN15_N OUT2+=IN16_P OUT2-=IN16_N PotA1=NetR62.15_1 PotA2=NetR62.16_1 PotB1=NetR63.15_2 PotB2=NetR63.16_2 PotW1=V1 PotW2=V1

### Notes on the sheet
- FROM XLR/JACK 1
- FROM XLR/JACK 2
- TO SW1 DPDT
- TO SW2 DPDT
- TO SW1 AND SW2 DPDT
- Sheet Name
- Project Title
- Size
- Group
- Revision
- Date :
- Filename :
- Sheet
- Authors :
- of

### Library data of the parts
J6 = CON_XH_JST_7pins: Mfg: JST Sales America Inc.; Supplier1: Digikey; Mfg_PN: B7B-XH-A(LF)(SN)
J7 = CON_XH_JST_6pins: Mfg: JST Sales America Inc.; Supplier1: Digikey

## Sheet InputAmplifier.SchDoc
size Tabloid; DocumentNumber: 11; SheetNumber: 11; SheetTotal: 11; SheetName: Audio input amplifier; Size: 11x17; Sheet_Name: Audio input amplifier
Used 16 times, as channels AUDIO INPUTS/U_InputsConnectors/U_InputAmplifier, AUDIO INPUTS/U_InputsConnectors/U_InputAmplifier, AUDIO INPUTS/U_InputsConnectors/U_InputAmplifier, AUDIO INPUTS/U_InputsConnectors/U_InputAmplifier, AUDIO INPUTS/U_InputsConnectors/U_InputAmplifier, AUDIO INPUTS/U_InputsConnectors/U_InputAmplifier, AUDIO INPUTS/U_InputsConnectors/U_InputAmplifier, AUDIO INPUTS/U_InputsConnectors/U_InputAmplifier, AUDIO INPUTS/U_InputsConnectors/U_InputAmplifier, AUDIO INPUTS/U_InputsConnectors/U_InputAmplifier, AUDIO INPUTS/U_InputsConnectors/U_InputAmplifier, AUDIO INPUTS/U_InputsConnectors/U_InputAmplifier, AUDIO INPUTS/U_InputsConnectors/U_InputAmplifier, AUDIO INPUTS/U_InputsConnectors/U_InputAmplifier, AUDIO INPUTS/U_InputsConnectors/U_InputAmplifier, AUDIO INPUTS/U_InputsConnectors/U_InputAmplifier. Parts and nets are listed once, with the designators drawn on the sheet.
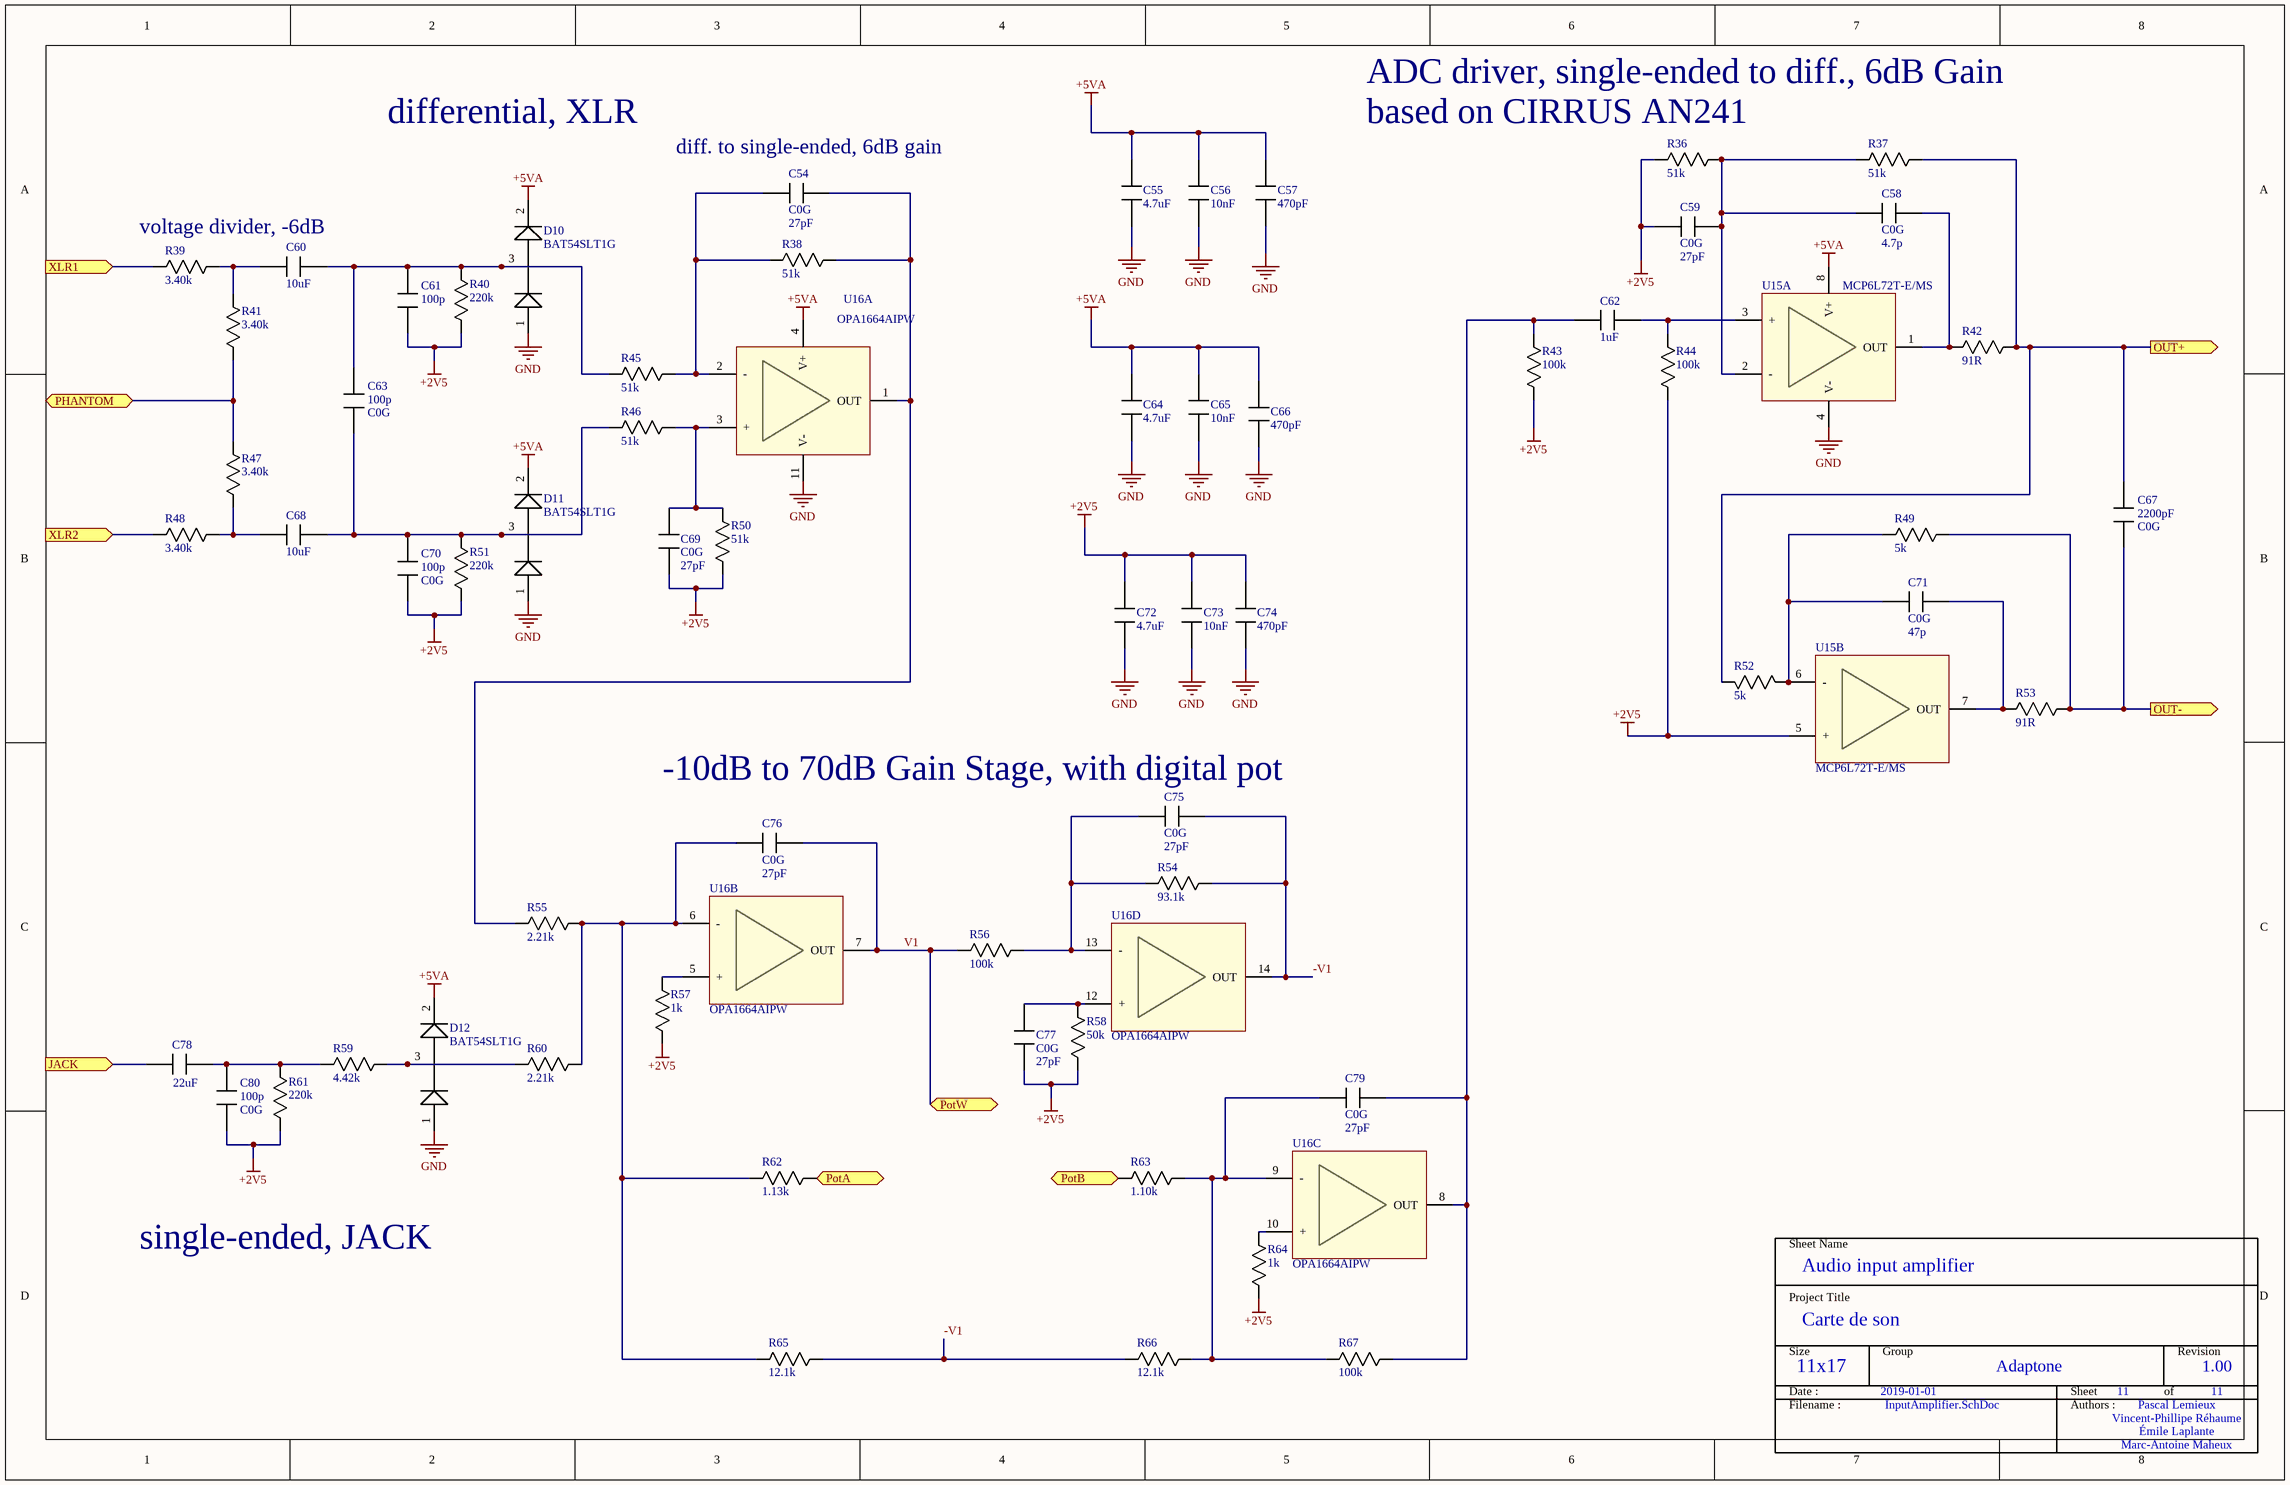
[diagram p9: InputAmplifier.SchDoc]

### Parts
C54  value 27pF  Type: C0G  [0402]  (hidden comment: Capacitor)
C55  value 4.7uF  [0402]  (hidden comment: Capacitor)
C56  value 10nF  [0402]  (hidden comment: Capacitor)
C57  value 470pF  [0402]  (hidden comment: Capacitor)
C58  value 4.7p  Type: C0G  [0402]  (hidden comment: Capacitor)
C59  value 27pF  Type: C0G  [0402]  (hidden comment: Capacitor)
C60  value 10uF  [CAP_1210]  (hidden comment: Capacitor)
C61  value 100p  [0402]  (hidden comment: Capacitor)
C62  value 1uF  [0402]  (hidden comment: Capacitor)
C63  value 100p  Type: C0G  [0402]  (hidden comment: Capacitor)
C64  value 4.7uF  [0402]  (hidden comment: Capacitor)
C65  value 10nF  [0402]  (hidden comment: Capacitor)
C66  value 470pF  [0402]  (hidden comment: Capacitor)
C67  value 2200pF  Type: C0G  [0603]  (hidden comment: Capacitor)
C68  value 10uF  [CAP_1210]  (hidden comment: Capacitor)
C69  value 27pF  Type: C0G  [0402]  (hidden comment: Capacitor)
C70  value 100p  Type: C0G  [0402]  (hidden comment: Capacitor)
C71  value 47p  Type: C0G  [0402]  (hidden comment: Capacitor)
C72  value 4.7uF  [0402]  (hidden comment: Capacitor)
C73  value 10nF  [0402]  (hidden comment: Capacitor)
C74  value 470pF  [0402]  (hidden comment: Capacitor)
C75  value 27pF  Type: C0G  [0402]  (hidden comment: Capacitor)
C76  value 27pF  Type: C0G  [0402]  (hidden comment: Capacitor)
C77  value 27pF  Type: C0G  [0402]  (hidden comment: Capacitor)
C78  value 22uF  [0805]  (hidden comment: Capacitor)
C79  value 27pF  Type: C0G  [0402]  (hidden comment: Capacitor)
C80  value 100p  Type: C0G  [0402]  (hidden comment: Capacitor)
D10  Mfg_PN: BAT54SLT1G  [SOT23_132]  (hidden comment: Diode_dual)
D11  Mfg_PN: BAT54SLT1G  [SOT23_132]  (hidden comment: Diode_dual)
D12  Mfg_PN: BAT54SLT1G  [SOT23_132]  (hidden comment: Diode_dual)
R36  value 51k  [0402]  (hidden comment: Resistor)
R37  value 51k  [0402]  (hidden comment: Resistor)
R38  value 51k  [0402]  (hidden comment: Resistor)
R39  value 3.40k  [0402]  (hidden comment: Resistor)
R40  value 220k  [0402]  (hidden comment: Resistor)
R41  value 3.40k  [0402]  (hidden comment: Resistor)
R42  value 91R  [0402]  (hidden comment: Resistor)
R43  value 100k  [0402]  (hidden comment: Resistor)
R44  value 100k  [0402]  (hidden comment: Resistor)
R45  value 51k  [0402]  (hidden comment: Resistor)
R46  value 51k  [0402]  (hidden comment: Resistor)
R47  value 3.40k  [0402]  (hidden comment: Resistor)
R48  value 3.40k  [0402]  (hidden comment: Resistor)
R49  value 5k  [0402]  (hidden comment: Resistor)
R50  value 51k  [0402]  (hidden comment: Resistor)
R51  value 220k  [0402]  (hidden comment: Resistor)
R52  value 5k  [0402]  (hidden comment: Resistor)
R53  value 91R  [0402]  (hidden comment: Resistor)
R54  value 93.1k  [0402]  (hidden comment: Resistor)
R55  value 2.21k  [0402]  (hidden comment: Resistor)
R56  value 100k  [0402]  (hidden comment: Resistor)
R57  value 1k  [0402]  (hidden comment: Resistor)
R58  value 50k  [0402]  (hidden comment: Resistor)
R59  value 4.42k  [0402]  (hidden comment: Resistor)
R60  value 2.21k  [0402]  (hidden comment: Resistor)
R61  value 220k  [0402]  (hidden comment: Resistor)
R62  value 1.13k  [0402]  (hidden comment: Resistor)
R63  value 1.10k  [0402]  (hidden comment: Resistor)
R64  value 1k  [0402]  (hidden comment: Resistor)
R65  value 12.1k  [0402]  (hidden comment: Resistor)
R66  value 12.1k  [0402]  (hidden comment: Resistor)
R67  value 100k  [0402]  (hidden comment: Resistor)
U15  Mfg_PN: MCP6L72T-E/MS  [SOP127P600-8N]  (hidden comment: OPA_DUAL)  (parts A,B of 2)
U16  Mfg_PN: OPA1664AIPW  [14-TSSOP]  (hidden comment: OPA1664)  (parts A,B,C,D of 4)

### Ports
JACK (in), OUT+ (out), OUT- (out), PHANTOM (bidir), PotA (bidir), PotB (bidir), PotW (bidir), XLR1 (in), XLR2 (in)

### Nets
+2V5: C59.2 C61.2 C69.1 C70.2 C72.1 C73.1 C74.1 C77.1 C80.2 R36.1 R40.2 R43.1 R44.1 R50.2 R51.2 R57.1 R58.2 R61.2 R64.1 U15.5(+)
+5VA: C55.1 C56.1 C57.1 C64.1 C65.1 C66.1 D10.2(K) D11.2(K) D12.2(K) U15.8(V+) U16.4(V+)
GND: C55.2 C56.2 C57.2 C64.2 C65.2 C66.2 C72.2 C73.2 C74.2 D10.1(K) D11.1(K) D12.1(K) U15.4(V-) U16.11(V-)
-V1: C75.2 R54.1 R65.1 R66.2 U16.14(OUT)
JACK: C78.1 ; port JACK
OUT+: C67.1 R37.2 R42.2 R52.2 ; port OUT+
OUT-: C67.2 R49.2 R53.2 ; port OUT-
PHANTOM: R41.2 R47.1 ; port PHANTOM
PotA: R62.1 ; port PotA
PotB: R63.2 ; port PotB
V1: C76.2 R56.1 U16.7(OUT) ; port PotW
XLR1: R39.1 ; port XLR1
XLR2: R48.1 ; port XLR2
NetC54_1: C54.1 R38.2 R45.2 U16.2(-)
NetC54_2: C54.2 R38.1 R55.2 U16.1(OUT)
NetC58_1: C58.1 C59.1 R36.2 R37.1 U15.2(-)
NetC58_2: C58.2 R42.1 U15.1(OUT)
NetC60_1: C60.1 R39.2 R41.1
NetC60_2: C60.2 C61.1 C63.1 D10.3(AK) R40.1 R45.1
NetC62_1: C62.1 C79.2 R43.2 R67.1 U16.8(OUT)
NetC62_2: C62.2 R44.2 U15.3(+)
NetC63_2: C63.2 C68.2 C70.1 D11.3(AK) R46.1 R51.1
NetC68_1: C68.1 R47.2 R48.2
NetC69_2: C69.2 R46.2 R50.1 U16.3(+)
NetC71_1: C71.1 R49.1 R52.1 U15.6(-)
NetC71_2: C71.2 R53.1 U15.7(OUT)
NetC75_1: C75.1 R54.2 R56.2 U16.13(-)
NetC76_1: C76.1 R55.1 R60.1 R62.2 R65.2 U16.6(-)
NetC77_2: C77.2 R58.1 U16.12(+)
NetC78_2: C78.2 C80.1 R59.2 R61.1
NetC79_1: C79.1 R63.1 R66.1 R67.2 U16.9(-)
NetD12_3: D12.3(AK) R59.1 R60.2
NetR57_2: R57.2 U16.5(+)
NetR64_2: R64.2 U16.10(+)

### Channels
AUDIO INPUTS/U_InputsConnectors/U_InputAmplifier: designators end in .1; ports JACK=NetC78.1_1 OUT+=IN1_P OUT-=IN1_N PHANTOM=PHANTOM1_U_InputsConnectors PotA=NetR62.1_1 PotB=NetR63.1_2 PotW=V1 XLR1=NetJ6.1_3 XLR2=NetJ6.1_2
AUDIO INPUTS/U_InputsConnectors/U_InputAmplifier: designators end in .2; ports JACK=NetC78.2_1 OUT+=IN2_P OUT-=IN2_N PHANTOM=PHANTOM2_U_InputsConnectors PotA=NetR62.2_1 PotB=NetR63.2_2 PotW=V1 XLR1=NetJ6.1_5 XLR2=NetJ6.1_6
AUDIO INPUTS/U_InputsConnectors/U_InputAmplifier: designators end in .3; ports JACK=NetC78.3_1 OUT+=IN3_P OUT-=IN3_N PHANTOM=PHANTOM1_U_InputsConnectors PotA=NetR62.3_1 PotB=NetR63.3_2 PotW=V1 XLR1=NetJ6.2_3 XLR2=NetJ6.2_2
AUDIO INPUTS/U_InputsConnectors/U_InputAmplifier: designators end in .4; ports JACK=NetC78.4_1 OUT+=IN4_P OUT-=IN4_N PHANTOM=PHANTOM2_U_InputsConnectors PotA=NetR62.4_1 PotB=NetR63.4_2 PotW=V1 XLR1=NetJ6.2_5 XLR2=NetJ6.2_6
AUDIO INPUTS/U_InputsConnectors/U_InputAmplifier: designators end in .5; ports JACK=NetC78.5_1 OUT+=IN5_P OUT-=IN5_N PHANTOM=PHANTOM1_U_InputsConnectors PotA=NetR62.5_1 PotB=NetR63.5_2 PotW=V1 XLR1=NetJ6.3_3 XLR2=NetJ6.3_2
AUDIO INPUTS/U_InputsConnectors/U_InputAmplifier: designators end in .6; ports JACK=NetC78.6_1 OUT+=IN6_P OUT-=IN6_N PHANTOM=PHANTOM2_U_InputsConnectors PotA=NetR62.6_1 PotB=NetR63.6_2 PotW=V1 XLR1=NetJ6.3_5 XLR2=NetJ6.3_6
AUDIO INPUTS/U_InputsConnectors/U_InputAmplifier: designators end in .7; ports JACK=NetC78.7_1 OUT+=IN7_P OUT-=IN7_N PHANTOM=PHANTOM1_U_InputsConnectors PotA=NetR62.7_1 PotB=NetR63.7_2 PotW=V1 XLR1=NetJ6.4_3 XLR2=NetJ6.4_2
AUDIO INPUTS/U_InputsConnectors/U_InputAmplifier: designators end in .8; ports JACK=NetC78.8_1 OUT+=IN8_P OUT-=IN8_N PHANTOM=PHANTOM2_U_InputsConnectors PotA=NetR62.8_1 PotB=NetR63.8_2 PotW=V1 XLR1=NetJ6.4_5 XLR2=NetJ6.4_6
AUDIO INPUTS/U_InputsConnectors/U_InputAmplifier: designators end in .9; ports JACK=NetC78.9_1 OUT+=IN9_P OUT-=IN9_N PHANTOM=PHANTOM1_U_InputsConnectors PotA=NetR62.9_1 PotB=NetR63.9_2 PotW=V1 XLR1=NetJ6.5_3 XLR2=NetJ6.5_2
AUDIO INPUTS/U_InputsConnectors/U_InputAmplifier: designators end in .10; ports JACK=NetC78.10_1 OUT+=IN10_P OUT-=IN10_N PHANTOM=PHANTOM2_U_InputsConnectors PotA=NetR62.10_1 PotB=NetR63.10_2 PotW=V1 XLR1=NetJ6.5_5 XLR2=NetJ6.5_6
AUDIO INPUTS/U_InputsConnectors/U_InputAmplifier: designators end in .11; ports JACK=NetC78.11_1 OUT+=IN11_P OUT-=IN11_N PHANTOM=PHANTOM1_U_InputsConnectors PotA=NetR62.11_1 PotB=NetR63.11_2 PotW=V1 XLR1=NetJ6.6_3 XLR2=NetJ6.6_2
AUDIO INPUTS/U_InputsConnectors/U_InputAmplifier: designators end in .12; ports JACK=NetC78.12_1 OUT+=IN12_P OUT-=IN12_N PHANTOM=PHANTOM2_U_InputsConnectors PotA=NetR62.12_1 PotB=NetR63.12_2 PotW=V1 XLR1=NetJ6.6_5 XLR2=NetJ6.6_6
AUDIO INPUTS/U_InputsConnectors/U_InputAmplifier: designators end in .13; ports JACK=NetC78.13_1 OUT+=IN13_P OUT-=IN13_N PHANTOM=PHANTOM1_U_InputsConnectors PotA=NetR62.13_1 PotB=NetR63.13_2 PotW=V1 XLR1=NetJ6.7_3 XLR2=NetJ6.7_2
AUDIO INPUTS/U_InputsConnectors/U_InputAmplifier: designators end in .14; ports JACK=NetC78.14_1 OUT+=IN14_P OUT-=IN14_N PHANTOM=PHANTOM2_U_InputsConnectors PotA=NetR62.14_1 PotB=NetR63.14_2 PotW=V1 XLR1=NetJ6.7_5 XLR2=NetJ6.7_6
AUDIO INPUTS/U_InputsConnectors/U_InputAmplifier: designators end in .15; ports JACK=NetC78.15_1 OUT+=IN15_P OUT-=IN15_N PHANTOM=PHANTOM1_U_InputsConnectors PotA=NetR62.15_1 PotB=NetR63.15_2 PotW=V1 XLR1=NetJ6.8_3 XLR2=NetJ6.8_2
AUDIO INPUTS/U_InputsConnectors/U_InputAmplifier: designators end in .16; ports JACK=NetC78.16_1 OUT+=IN16_P OUT-=IN16_N PHANTOM=PHANTOM2_U_InputsConnectors PotA=NetR62.16_1 PotB=NetR63.16_2 PotW=V1 XLR1=NetJ6.8_5 XLR2=NetJ6.8_6

### Notes on the sheet
- ADC driver, single-ended to diff., 6dB Gain
- differential, XLR
- (near C54) diff. to single-ended, 6dB gain
- (near R36) based on CIRRUS AN241
- voltage divider, -6dB
- (near C75) -10dB to 70dB Gain Stage, with digital pot
- single-ended, JACK
- Sheet Name
- Project Title
- Size
- Group
- Revision
- Date :
- Filename :
- Sheet
- Authors :
- of

### Library data of the parts
C54 C58 C59 C69 C71 C75-C77 C79 = Capacitor: Mfg: Samsung; Mfg_PN: CL10C471JB8NCNC; HelpURL: *; NI: *; Supplier1: Digikey; Supplier1_PN: 1276-2302-1-ND; Tolerance: *; Rating: *
C55 C64 C72 = Capacitor: Mfg: Samsung; Mfg_PN: CL05A475MP5NRNC; HelpURL: *; NI: *; Supplier1: Digikey; Supplier1_PN: 1276-1482-1-ND; Tolerance: *; Type: *; Rating: *
C56 C65 C73 = Capacitor: Mfg: Samsung; Mfg_PN: CL05B103KO5NNNC; HelpURL: *; NI: *; Supplier1: Digikey; Supplier1_PN: 1276-1051-1-ND; Tolerance: *; Type: *; Rating: *
C57 C61 C66 C74 = Capacitor: Mfg: Murata; Mfg_PN: GRM155R71H471KA01D; HelpURL: *; NI: *; Supplier1: Digikey; Supplier1_PN: 490-1300-1-ND; Tolerance: *; Rating: *
  C57 C66 C74: Type: *
C60 C68 = Capacitor: Mfg: Samsung; Mfg_PN: CL32B106KMVNNWE; HelpURL: https://www.digikey.ca/product-detail/en/samsung-electro-mechanics/CL32B106KMVNNWE/1276-7053-1-ND/7320695; NI: NI; Supplier1: Digikey; Supplier1_PN: 1276-7053-1-ND; Tolerance: *; Type: *; Rating: *
C62 = Capacitor: Mfg: Samsung Electro-Mechanics; Mfg_PN: CL05A105MP5NNNC; HelpURL: *; NI: *; Supplier1: Digikey; Supplier1_PN: 1276-1448-1-ND; Tolerance: *; Type: *; Rating: *
C63 C70 C80 = Capacitor: Mfg: Yageo; Mfg_PN: CC0402JRNPO9BN101; HelpURL: *; NI: *; Supplier1: Digikey; Supplier1_PN: 311-1024-1-ND; Tolerance: *; Rating: *
C67 = Capacitor: Mfg: Murata; Mfg_PN: GRM1885C1H222JA01D; HelpURL: *; NI: *; Supplier1: Digikey; Supplier1_PN: 490-1459-1-ND; Tolerance: *; Rating: *
C78 = Capacitor: Mfg: Samsung Electro-Mechanics; Mfg_PN: CL21A226MOCLRNC; HelpURL: *; NI: *; Supplier1: Digikey; Supplier1_PN: 1276-6780-1-ND; Tolerance: *; Rating: *
D10-D12 = Diode_dual: Diode; Mfg: Onsemi; HelpURL: *; NI: *; Supplier1: Digikey; Supplier1_PN: BAT54SLT1GOSCT-ND; Tolerance: *; Type: *; Rating: *; Value: *
R36 R37 R49 R52 = Resistor: Mfg: Yageo; Mfg_PN: RC0603FR-07634RL; HelpURL: *; NI: *; Supplier1: Digikey; Supplier1_PN: 311-634HRCT-ND; Type: *; Rating: *; Tolerance: *
R38-R41 R43-R48 R50 R51 R54-R67 = Resistor: Mfg: Yageo; Mfg_PN: 311-10GRCT-ND; HelpURL: *; NI: *; Supplier1: Digikey; Supplier1_PN: 311-100KGRCT-ND; Type: *; Rating: *; Tolerance: *
R42 R53 = Resistor: Mfg: Yageo; Mfg_PN: RC0603JR-0791RL; HelpURL: *; NI: *; Supplier1: Digikey; Supplier1_PN: 311-91GRCT-ND; Type: *; Rating: *; Tolerance: *
U15 = OPA_DUAL: Dual amplifier (standard); Mfg: Microchip; HelpURL: *; NI: *; Rating: *; Supplier1: Digikey; Supplier1_PN: MCP6L72T-E/MSCT-ND; Tolerance: *; Value: *
U16 = OPA1664: Quad amplifier (audio); Mfg: Texas Instruments; HelpURL: *; NI: *; Rating: *; Supplier1: Digikey; Supplier1_PN: 296-34981-ND; Tolerance: *; Value: *

## Sheet AudioOutputs_16.SchDoc
size Tabloid; Size: 11x17; Sheet_Name: AudioOutputs_16
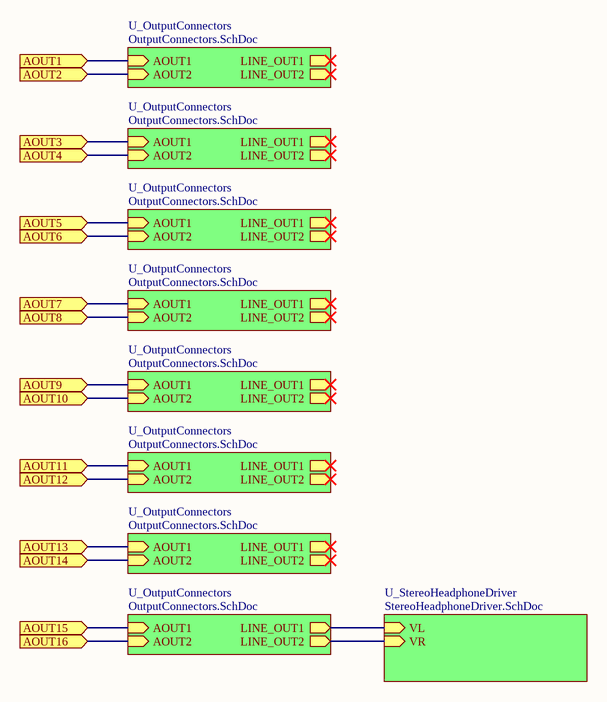
[diagram p10: AudioOutputs_16.SchDoc]

### Sub-sheets
U_OutputConnectors = OutputConnectors.SchDoc: AOUT1 (in), AOUT2 (in), LINE_OUT1 (out), LINE_OUT2 (out)
U_OutputConnectors = OutputConnectors.SchDoc: AOUT1 (in), AOUT2 (in), LINE_OUT1 (out), LINE_OUT2 (out)
U_OutputConnectors = OutputConnectors.SchDoc: AOUT1 (in), AOUT2 (in), LINE_OUT1 (out), LINE_OUT2 (out)
U_OutputConnectors = OutputConnectors.SchDoc: AOUT1 (in), AOUT2 (in), LINE_OUT1 (out), LINE_OUT2 (out)
U_OutputConnectors = OutputConnectors.SchDoc: AOUT1 (in), AOUT2 (in), LINE_OUT1 (out), LINE_OUT2 (out)
U_OutputConnectors = OutputConnectors.SchDoc: AOUT1 (in), AOUT2 (in), LINE_OUT1 (out), LINE_OUT2 (out)
U_OutputConnectors = OutputConnectors.SchDoc: AOUT1 (in), AOUT2 (in), LINE_OUT1 (out), LINE_OUT2 (out)
U_OutputConnectors = OutputConnectors.SchDoc: AOUT1 (in), AOUT2 (in), LINE_OUT1 (out), LINE_OUT2 (out)
U_StereoHeadphoneDriver = StereoHeadphoneDriver.SchDoc: VL (in), VR (in)

### Ports
AOUT1 (in), AOUT2 (in), AOUT3 (in), AOUT4 (in), AOUT5 (in), AOUT6 (in), AOUT7 (in), AOUT8 (in), AOUT9 (in), AOUT10 (in), AOUT11 (in), AOUT12 (in), AOUT13 (in), AOUT14 (in), AOUT15 (in), AOUT16 (in)

### Nets
AOUT1: port AOUT1, sheet U_OutputConnectors/AOUT1
AOUT2: port AOUT2, sheet U_OutputConnectors/AOUT2
AOUT3: port AOUT3, sheet U_OutputConnectors/AOUT1
AOUT4: port AOUT4, sheet U_OutputConnectors/AOUT2
AOUT5: port AOUT5, sheet U_OutputConnectors/AOUT1
AOUT6: port AOUT6, sheet U_OutputConnectors/AOUT2
AOUT7: port AOUT7, sheet U_OutputConnectors/AOUT1
AOUT8: port AOUT8, sheet U_OutputConnectors/AOUT2
AOUT9: port AOUT9, sheet U_OutputConnectors/AOUT1
AOUT10: port AOUT10, sheet U_OutputConnectors/AOUT2
AOUT11: port AOUT11, sheet U_OutputConnectors/AOUT1
AOUT12: port AOUT12, sheet U_OutputConnectors/AOUT2
AOUT13: port AOUT13, sheet U_OutputConnectors/AOUT1
AOUT14: port AOUT14, sheet U_OutputConnectors/AOUT2
AOUT15: port AOUT15, sheet U_OutputConnectors/AOUT1
AOUT16: port AOUT16, sheet U_OutputConnectors/AOUT2
NetC128.8_2: sheet U_OutputConnectors/LINE_OUT1, sheet U_StereoHeadphoneDriver/VL
NetC138.8_2: sheet U_OutputConnectors/LINE_OUT2, sheet U_StereoHeadphoneDriver/VR

### Notes on the sheet
- Sheet Name
- Project Title
- Size
- Group
- Revision
- Date :
- Filename :
- Sheet
- Authors :
- of

## Sheet OutputConnectors.SchDoc
size Tabloid; DocumentNumber: 8; SheetNumber: 8; SheetTotal: 11; SheetName: Audio output connectors; Size: 11x17; Sheet_Name: OutputConnectos
Used 8 times, as channels U_AudioOutputs_16/U_OutputConnectors, U_AudioOutputs_16/U_OutputConnectors, U_AudioOutputs_16/U_OutputConnectors, U_AudioOutputs_16/U_OutputConnectors, U_AudioOutputs_16/U_OutputConnectors, U_AudioOutputs_16/U_OutputConnectors, U_AudioOutputs_16/U_OutputConnectors, U_AudioOutputs_16/U_OutputConnectors. Parts and nets are listed once, with the designators drawn on the sheet.
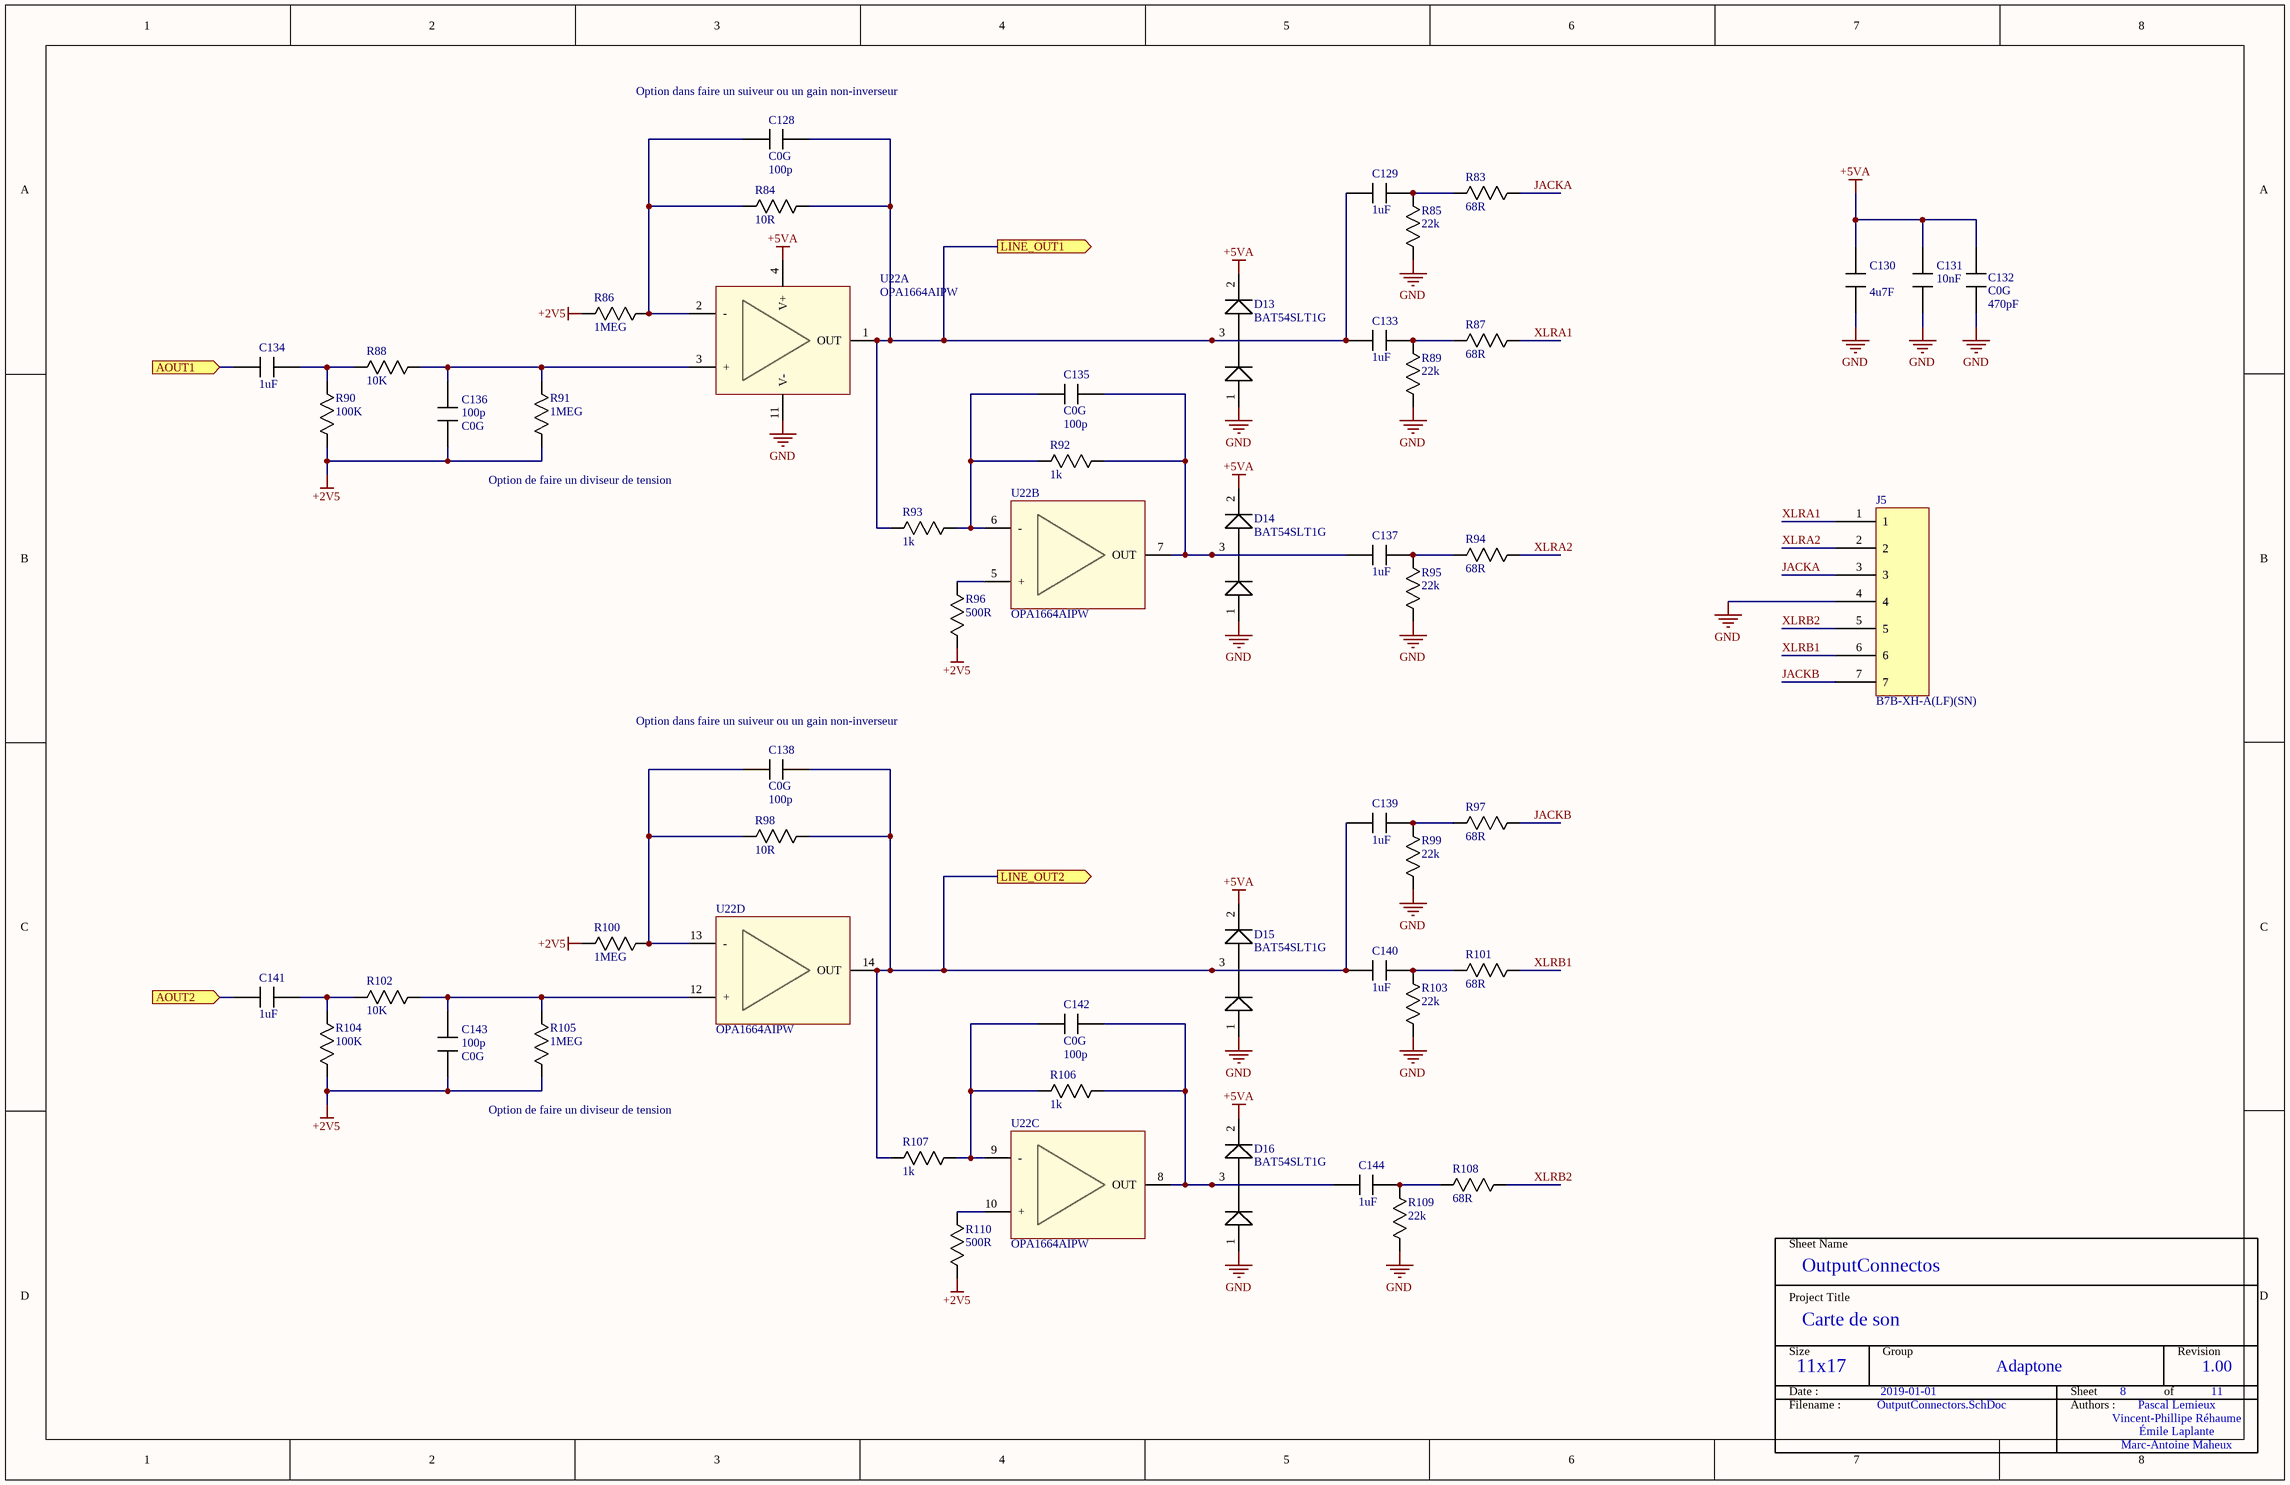
[diagram p11: OutputConnectors.SchDoc]

### Parts
C128  value 100p  Type: C0G  [0402]  (hidden comment: Capacitor)
C129  value 1uF  [0402]  (hidden comment: Capacitor)
C130  value 4u7F  [0805]  (hidden comment: Capacitor)
C131  value 10nF  [0603]  (hidden comment: Capacitor)
C132  value 470pF  Type: C0G  [0603]  (hidden comment: Capacitor)
C133  value 1uF  [0402]  (hidden comment: Capacitor)
C134  value 1uF  [0402]  (hidden comment: Capacitor)
C135  value 100p  Type: C0G  [0402]  (hidden comment: Capacitor)
C136  value 100p  Type: C0G  [0402]  (hidden comment: Capacitor)
C137  value 1uF  [0402]  (hidden comment: Capacitor)
C138  value 100p  Type: C0G  [0402]  (hidden comment: Capacitor)
C139  value 1uF  [0402]  (hidden comment: Capacitor)
C140  value 1uF  [0402]  (hidden comment: Capacitor)
C141  value 1uF  [0402]  (hidden comment: Capacitor)
C142  value 100p  Type: C0G  [0402]  (hidden comment: Capacitor)
C143  value 100p  Type: C0G  [0402]  (hidden comment: Capacitor)
C144  value 1uF  [0402]  (hidden comment: Capacitor)
D13  Mfg_PN: BAT54SLT1G  [SOT23_132]  (hidden comment: Diode_dual)
D14  Mfg_PN: BAT54SLT1G  [SOT23_132]  (hidden comment: Diode_dual)
D15  Mfg_PN: BAT54SLT1G  [SOT23_132]  (hidden comment: Diode_dual)
D16  Mfg_PN: BAT54SLT1G  [SOT23_132]  (hidden comment: Diode_dual)
J5  B7B-XH-A(LF)(SN)  [CONN_7_HEADER]
R83  value 68R  [0402]  (hidden comment: Resistor)
R84  value 10R  [0402]  (hidden comment: Resistor)
R85  value 22k  [0402]  (hidden comment: Resistor)
R86  value 1MEG  [0402]  (hidden comment: Resistor)
R87  value 68R  [0402]  (hidden comment: Resistor)
R88  value 10K  [0402]  (hidden comment: Resistor)
R89  value 22k  [0402]  (hidden comment: Resistor)
R90  value 100K  [0402]  (hidden comment: Resistor)
R91  value 1MEG  [0402]  (hidden comment: Resistor)
R92  value 1k  [0402]  (hidden comment: Resistor)
R93  value 1k  [0402]  (hidden comment: Resistor)
R94  value 68R  [0402]  (hidden comment: Resistor)
R95  value 22k  [0402]  (hidden comment: Resistor)
R96  value 500R  [0402]  (hidden comment: Resistor)
R97  value 68R  [0402]  (hidden comment: Resistor)
R98  value 10R  [0402]  (hidden comment: Resistor)
R99  value 22k  [0402]  (hidden comment: Resistor)
R100  value 1MEG  [0402]  (hidden comment: Resistor)
R101  value 68R  [0402]  (hidden comment: Resistor)
R102  value 10K  [0402]  (hidden comment: Resistor)
R103  value 22k  [0402]  (hidden comment: Resistor)
R104  value 100K  [0402]  (hidden comment: Resistor)
R105  value 1MEG  [0402]  (hidden comment: Resistor)
R106  value 1k  [0402]  (hidden comment: Resistor)
R107  value 1k  [0402]  (hidden comment: Resistor)
R108  value 68R  [0402]  (hidden comment: Resistor)
R109  value 22k  [0402]  (hidden comment: Resistor)
R110  value 500R  [0402]  (hidden comment: Resistor)
U22  Mfg_PN: OPA1664AIPW  [14-TSSOP]  (hidden comment: OPA1664)  (parts A,B,C,D of 4)

### Ports
AOUT1 (in), AOUT2 (in), LINE_OUT1 (out), LINE_OUT2 (out)

### Nets
+2V5: C136.2 C143.2 R86.2 R90.1 R91.1 R96.2 R100.2 R104.1 R105.1 R110.2
+5VA: C130.1 C131.1 C132.2 D13.2(K) D14.2(K) D15.2(K) D16.2(K) U22.4(V+)
GND: C130.2 C131.2 C132.1 D13.1(K) D14.1(K) D15.1(K) D16.1(K) J5.4 R85.1 R89.1 R95.1 R99.1 R103.1 R109.1 U22.11(V-)
AOUT1: C134.1 ; port AOUT1
AOUT2: C141.1 ; port AOUT2
JACKA: J5.3 R83.1
JACKB: J5.7 R97.1
LINE_OUT1: C128.2 C129.1 C133.1 D13.3(AK) R84.1 R93.2 U22.1(OUT) ; port LINE_OUT1
LINE_OUT2: C138.2 C139.1 C140.1 D15.3(AK) R98.1 R107.2 U22.14(OUT) ; port LINE_OUT2
XLRA1: J5.1 R87.1
XLRA2: J5.2 R94.1
XLRB1: J5.6 R101.1
XLRB2: J5.5 R108.1
NetC128_1: C128.1 R84.2 R86.1 U22.2(-)
NetC129_2: C129.2 R83.2 R85.2
NetC133_2: C133.2 R87.2 R89.2
NetC134_2: C134.2 R88.1 R90.2
NetC135_1: C135.1 R92.2 R93.1 U22.6(-)
NetC135_2: C135.2 C137.1 D14.3(AK) R92.1 U22.7(OUT)
NetC136_1: C136.1 R88.2 R91.2 U22.3(+)
NetC137_2: C137.2 R94.2 R95.2
NetC138_1: C138.1 R98.2 R100.1 U22.13(-)
NetC139_2: C139.2 R97.2 R99.2
NetC140_2: C140.2 R101.2 R103.2
NetC141_2: C141.2 R102.1 R104.2
NetC142_1: C142.1 R106.2 R107.1 U22.9(-)
NetC142_2: C142.2 C144.1 D16.3(AK) R106.1 U22.8(OUT)
NetC143_1: C143.1 R102.2 R105.2 U22.12(+)
NetC144_2: C144.2 R108.2 R109.2
NetR96_1: R96.1 U22.5(+)
NetR110_1: R110.1 U22.10(+)

### Channels
U_AudioOutputs_16/U_OutputConnectors: designators end in .1; ports AOUT1=AOUT1 AOUT2=AOUT2 LINE_OUT1=NetC128.1_2 LINE_OUT2=NetC138.1_2
U_AudioOutputs_16/U_OutputConnectors: designators end in .2; ports AOUT1=AOUT3 AOUT2=AOUT4 LINE_OUT1=NetC128.2_2 LINE_OUT2=NetC138.2_2
U_AudioOutputs_16/U_OutputConnectors: designators end in .3; ports AOUT1=AOUT5 AOUT2=AOUT6 LINE_OUT1=NetC128.3_2 LINE_OUT2=NetC138.3_2
U_AudioOutputs_16/U_OutputConnectors: designators end in .4; ports AOUT1=AOUT7 AOUT2=AOUT8 LINE_OUT1=NetC128.4_2 LINE_OUT2=NetC138.4_2
U_AudioOutputs_16/U_OutputConnectors: designators end in .5; ports AOUT1=AOUT9 AOUT2=AOUT10 LINE_OUT1=NetC128.5_2 LINE_OUT2=NetC138.5_2
U_AudioOutputs_16/U_OutputConnectors: designators end in .6; ports AOUT1=AOUT11 AOUT2=AOUT12 LINE_OUT1=NetC128.6_2 LINE_OUT2=NetC138.6_2
U_AudioOutputs_16/U_OutputConnectors: designators end in .7; ports AOUT1=AOUT13 AOUT2=AOUT14 LINE_OUT1=NetC128.7_2 LINE_OUT2=NetC138.7_2
U_AudioOutputs_16/U_OutputConnectors: designators end in .8; ports AOUT1=AOUT15 AOUT2=AOUT16 LINE_OUT1=NetC128.8_2 LINE_OUT2=NetC138.8_2

### Notes on the sheet
- (near C128) Option dans faire un suiveur ou un gain non-inverseur
- (near R91) Option de faire un diviseur de tension
- (near C138) Option dans faire un suiveur ou un gain non-inverseur
- (near R105) Option de faire un diviseur de tension
- Sheet Name
- Project Title
- Size
- Group
- Revision
- Date :
- Filename :
- Sheet
- Authors :
- of

### Library data of the parts
C128 C135 C136 C138 C142 C143 = Capacitor: Mfg: Yageo; Mfg_PN: CC0402JRNPO9BN101; HelpURL: *; NI: *; Supplier1: Digikey; Supplier1_PN: 311-1024-1-ND; Tolerance: *; Rating: *
C129 C133 C134 C137 C139-C141 C144 = Capacitor: as C62 on sheet InputAmplifier; HelpURL: *; NI: *; Supplier1: Digikey; Supplier1_PN: 1276-1448-1-ND; Tolerance: *; Type: *; Rating: *
C130 = Capacitor: Mfg: Samsung; Mfg_PN: CL21A475KAQNNNG; HelpURL: *; NI: *; Supplier1: Digikey; Supplier1_PN: 1276-6462-1-ND; Tolerance: *; Type: *; Rating: *
C131 = Capacitor: Mfg: Murata; Mfg_PN: CL05B103KO5NNNC; HelpURL: *; NI: *; Supplier1: Digikey; Supplier1_PN: 1276-1051-1-ND; Tolerance: *; Type: *; Rating: *
C132 = Capacitor: Mfg: Samsung; Mfg_PN: CL10C471JB8NCNC; HelpURL: *; NI: *; Supplier1: Digikey; Supplier1_PN: 1276-2302-1-ND; Tolerance: *; Rating: *
D13-D16 = Diode_dual: Diode; Mfg: Onsemi; HelpURL: *; NI: *; Supplier1: Digikey; Supplier1_PN: BAT54SLT1GOSCT-ND; Tolerance: *; Type: *; Rating: *; Value: *
J5 = CON_XH_JST_7pins: Mfg: JST Sales America Inc.; Supplier1: Digikey; Mfg_PN: B7B-XH-A(LF)(SN)
R83-R87 R89-R101 R103-R110 = Resistor: Mfg: Yageo; Mfg_PN: 311-10GRCT-ND; HelpURL: *; NI: *; Supplier1: Digikey; Supplier1_PN: 311-100KGRCT-ND; Type: *; Rating: *; Tolerance: *
R88 R102 = Resistor: Mfg: Yageo; Mfg_PN: RC0603JR-07470RL; HelpURL: *; NI: *; Supplier1: Digikey; Supplier1_PN: 311-470GRCT-ND; Type: *; Rating: *; Tolerance: *
U22 = OPA1664: as U16 on sheet InputAmplifier; HelpURL: *; NI: *; Rating: *; Supplier1: Digikey; Supplier1_PN: 296-34981-ND; Tolerance: *; Value: *